# EAGLE board Blueberry Pi (EAGLE 9.0.0), part 1 of 2
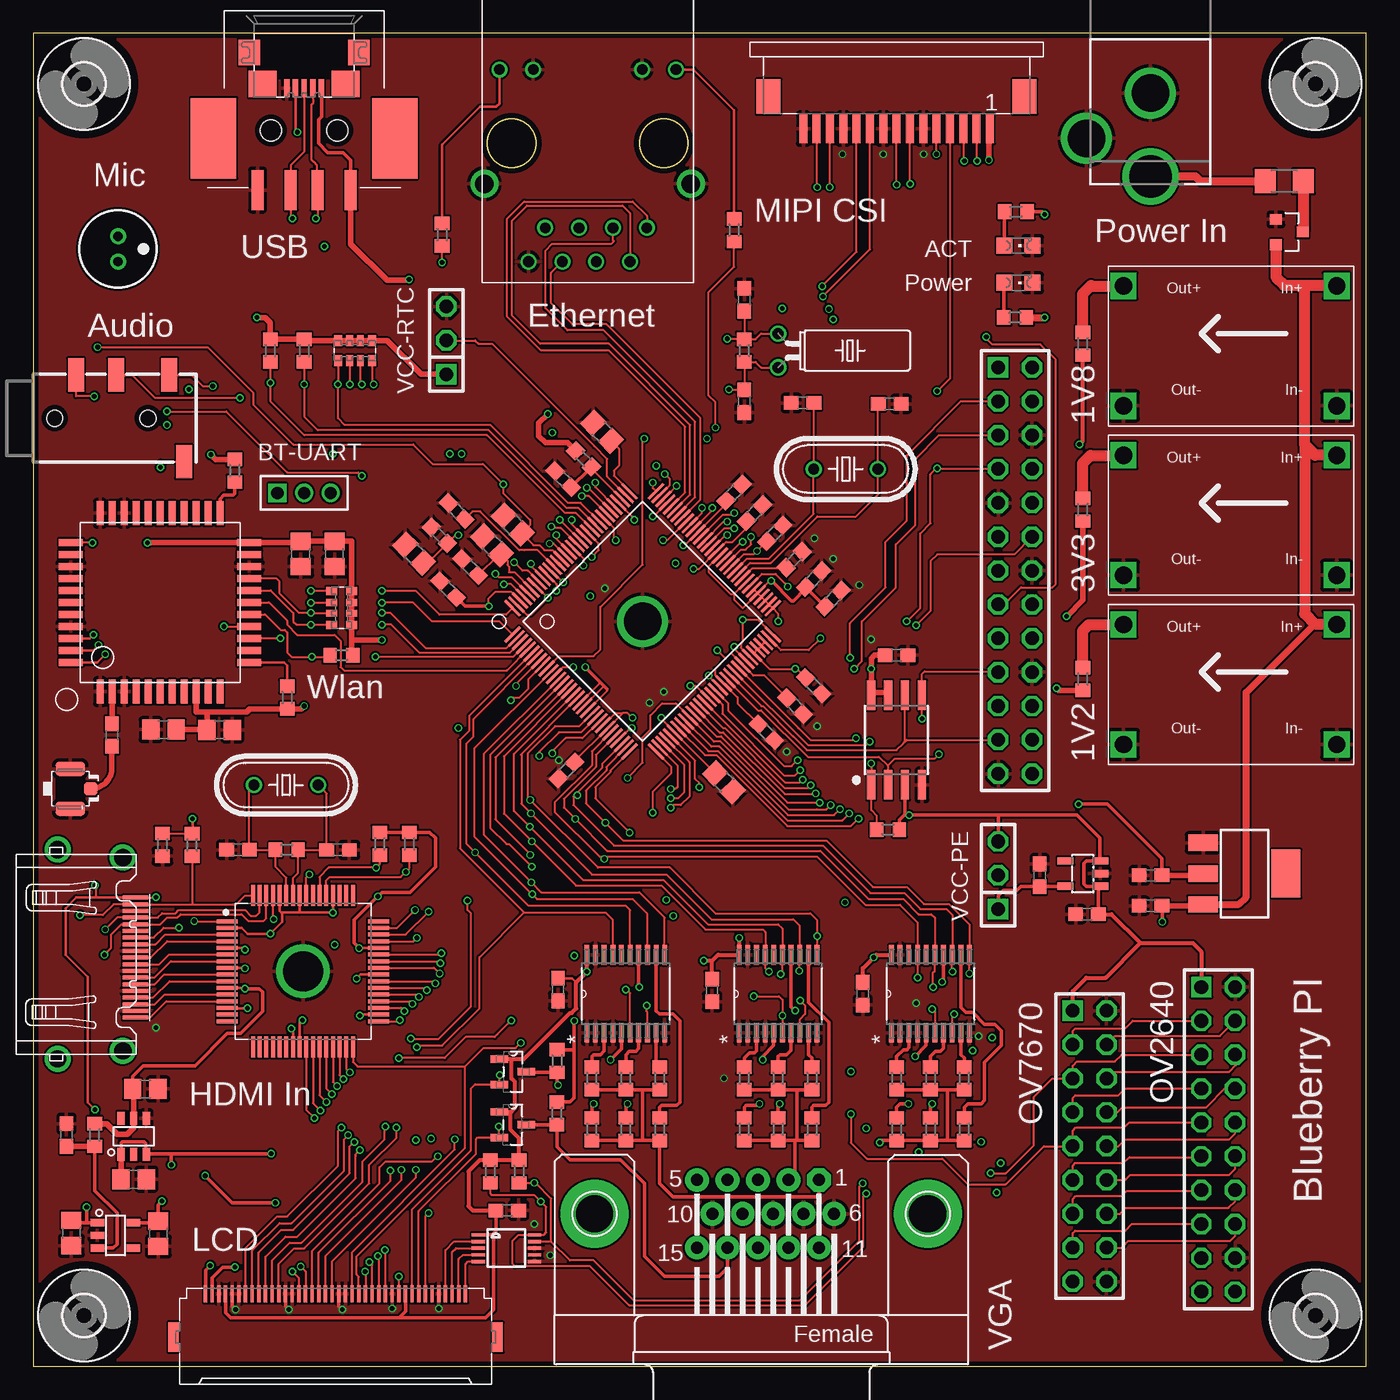
[diagram p6: board, top side]
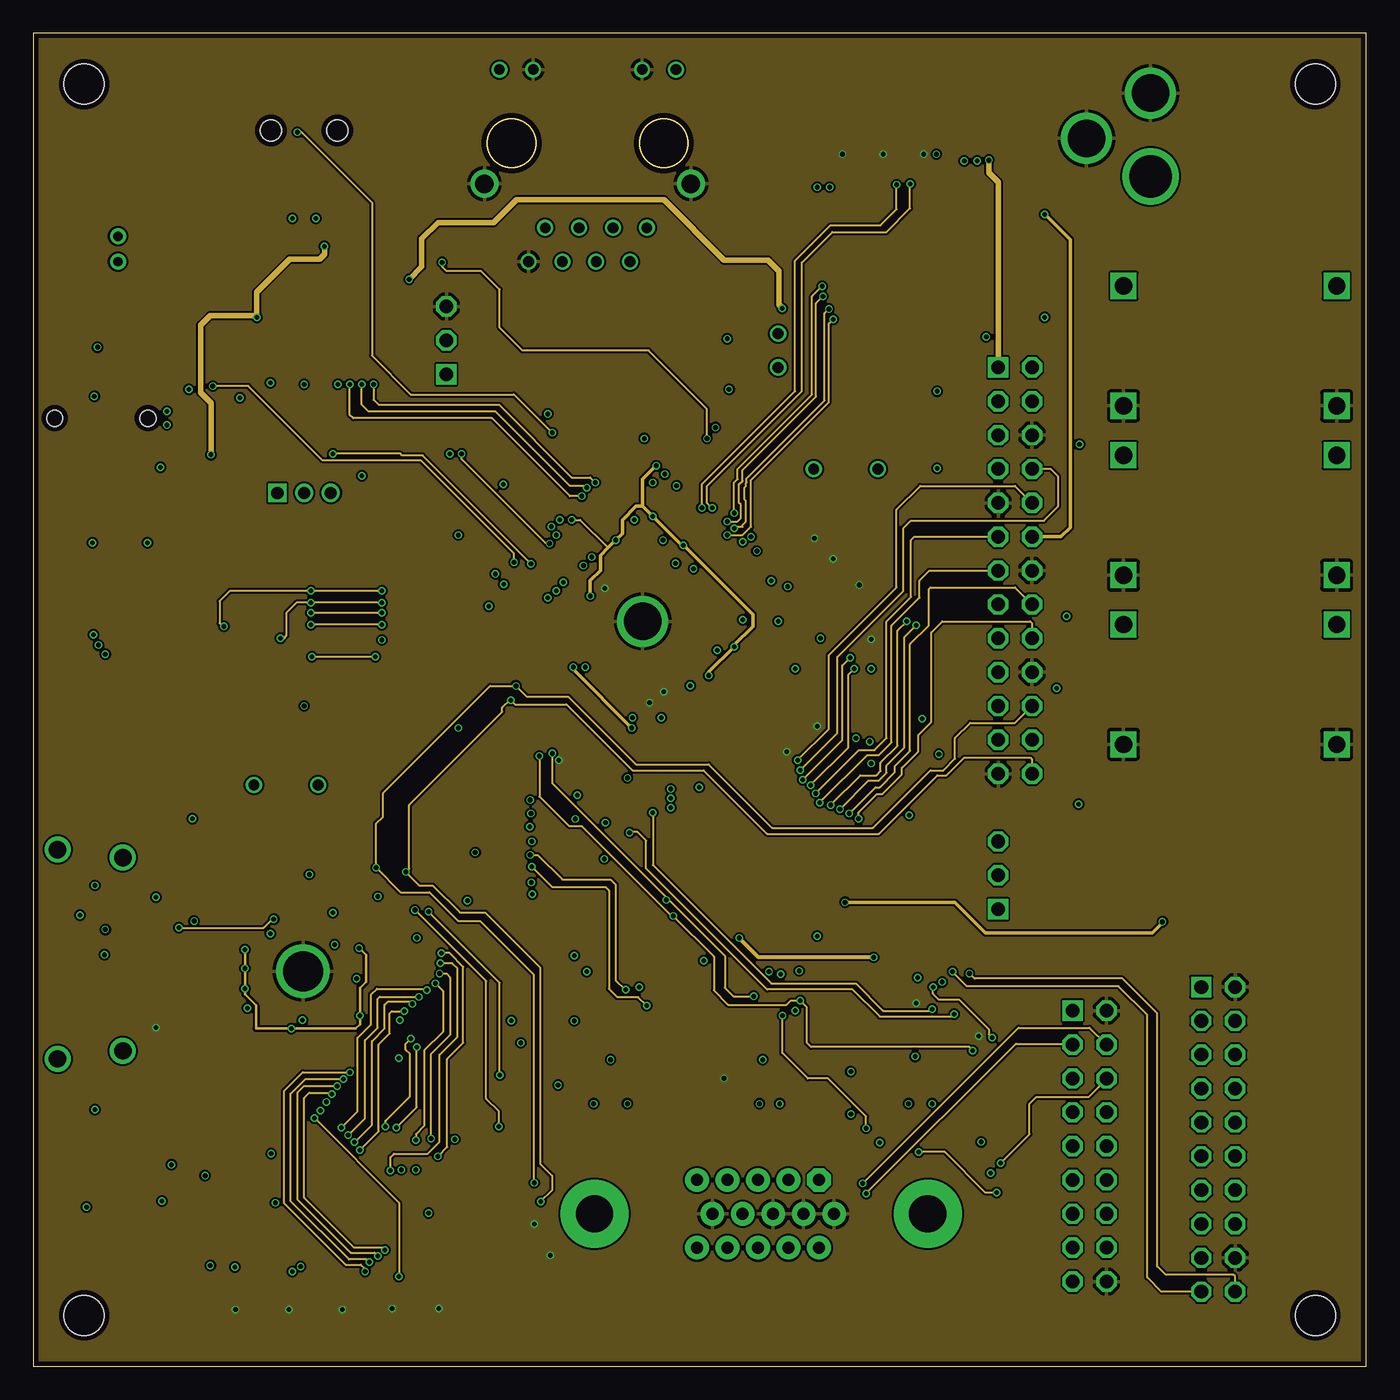
[diagram p7: board, inner layer Route2]
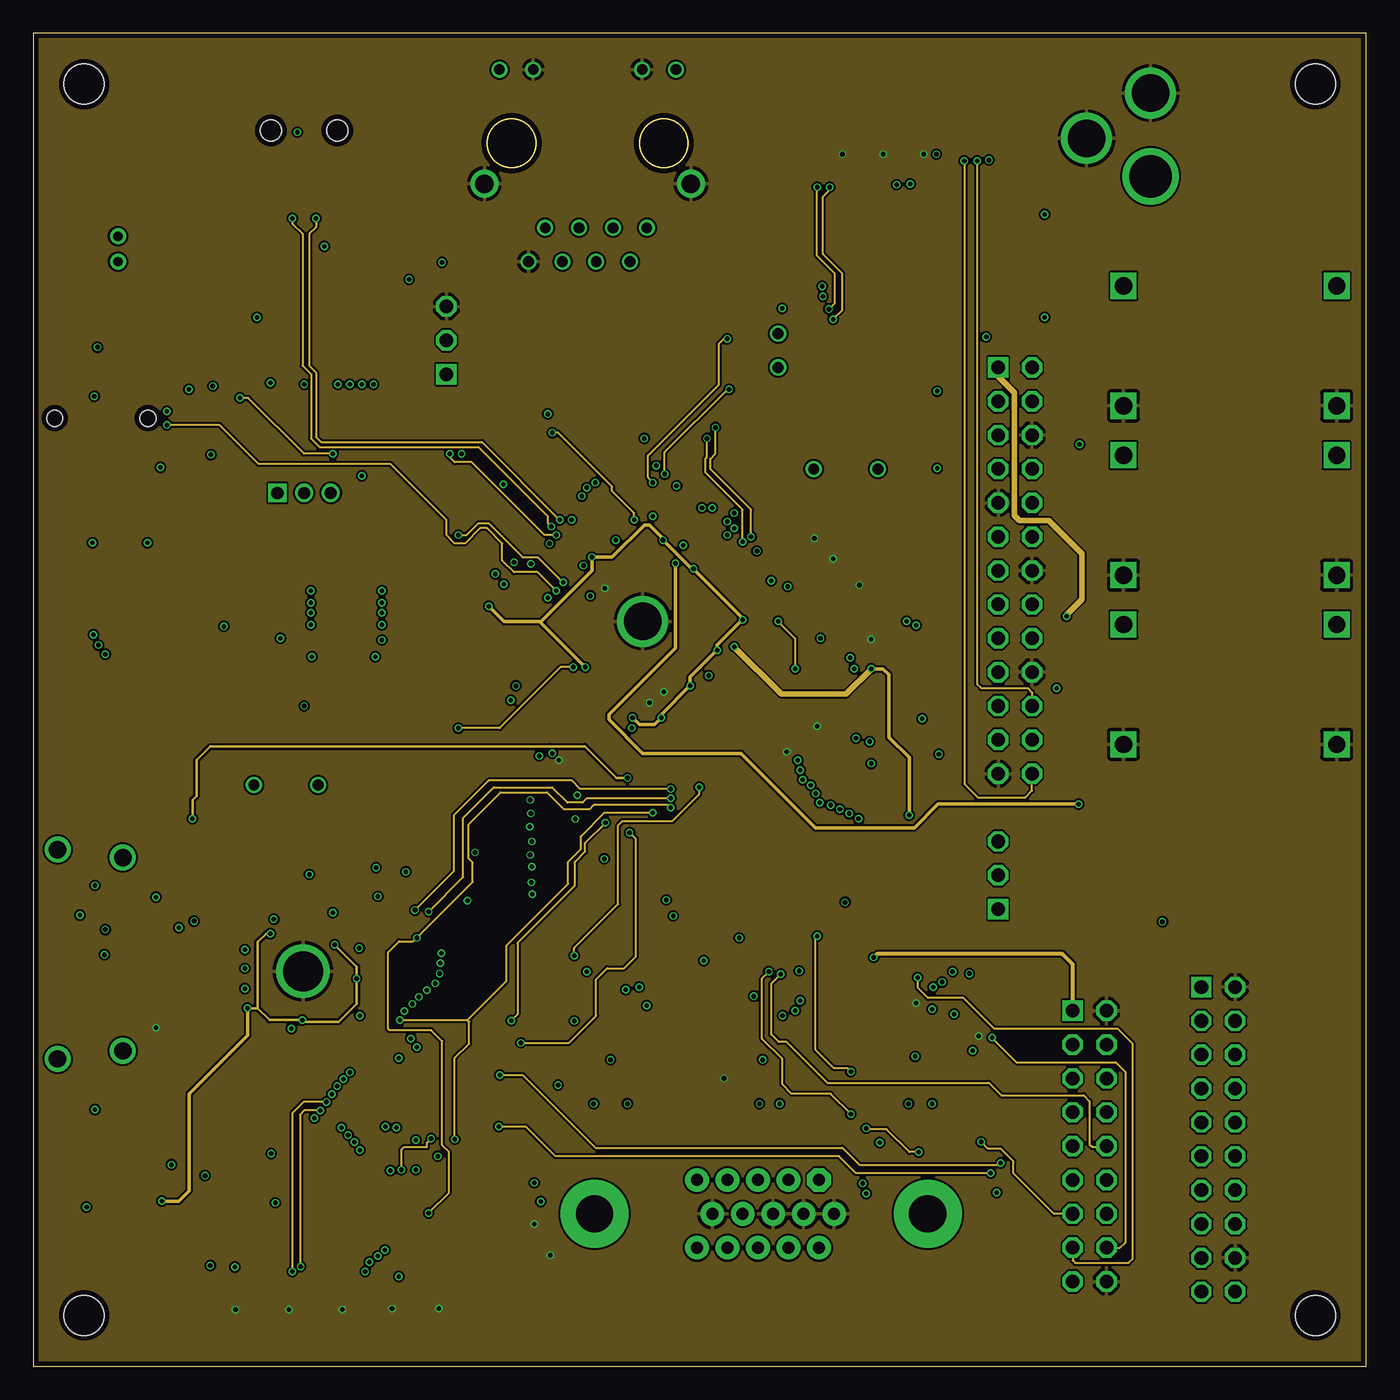
[diagram p8: board, inner layer Route15]
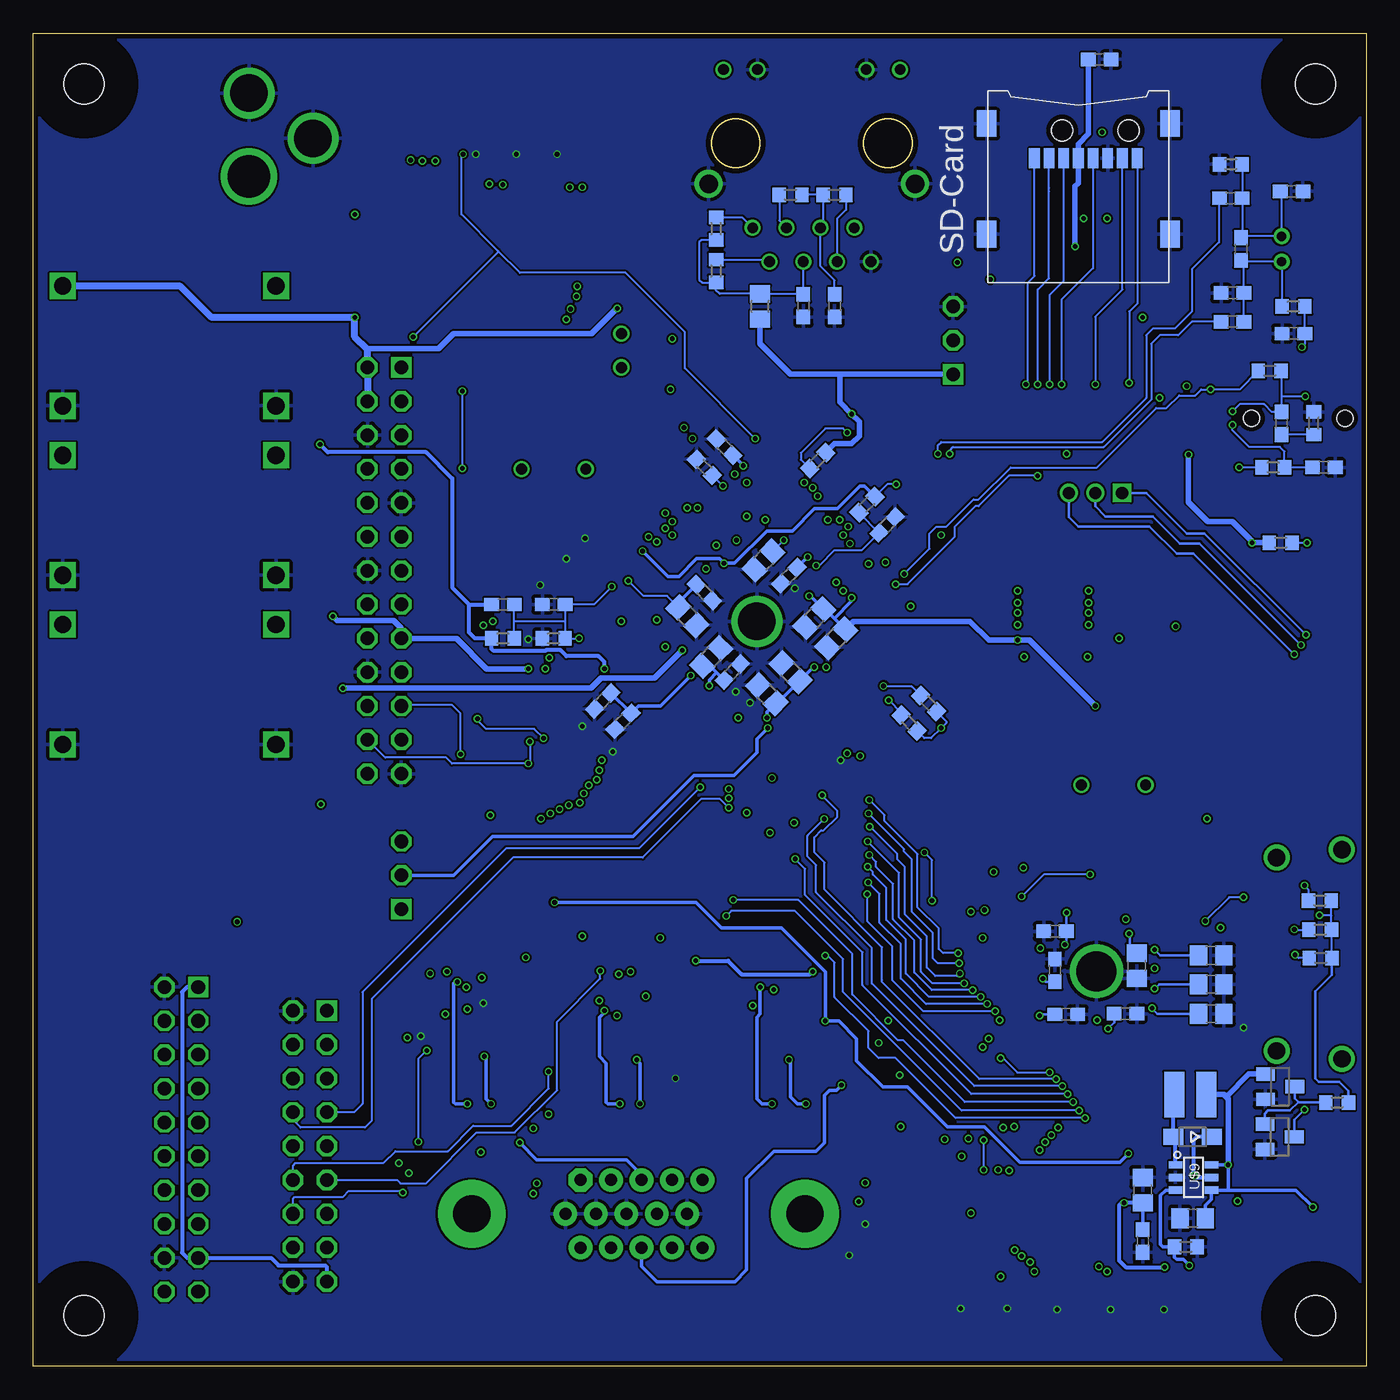
[diagram p9: board, bottom side, seen from below]

Size 100 x 100 mm. Coordinates in mm from the lower left corner, seen from the top.
Outline: 0,0 100,0 100,100 0,100 0,0
Copper layers (1*2*15*16): Top 0.035559375mm / dielectric 0.17018125mm / Route2 0.01778125mm / dielectric 47mil / Route15 0.01778125mm / dielectric 0.17018125mm / Bottom 0.035559375mm
Design rules "oshpark-4layer": minimum track width 5mil, minimum drill 10mil, track to track 5mil, track to pad 5mil, pad to pad 5mil, via to via 5mil, smd to smd 5mil, copper to edge 15mil, drill to drill 6mil, minimum pad ring 4mil, minimum via ring 4mil, stop-mask expansion 2.5mil, vias tented up to drill 0mil, thermal gap 10mil
Net classes: 0 default: clearance 0.152 mm

## Footprints (pad centres in the part's own frame; a part is rotated, then mirrored left to right if it is on the bottom)
U-FL3P-SMD-2.6X2.6X1.0MM = smd 1.05 x 1: D -1.524,0 | smd 2.2 x 1.05: GND1 0,1.5; GND2 0,-1.5
C0603 = smd 1.1 x 1: 1 -0.85,0; 2 0.85,0
C0805 = smd 1.3 x 1.5: 1 -0.95,0; 2 0.95,0
DCJACK_2MM_PTH = drill 2.8: GND 0,7.35; GNDBREAK 4.8,10.75 | drill 3.2: PWR 0,13.6
SOD323-W = smd 1.5 x 1.2: A 1.45,0; C -1.45,0
R1206 = smd 1.6 x 1.803: 1 -1.422,0; 2 1.422,0
3,0 = hole 3: 0,0
SOT223 = smd 1.219 x 2.235: 1 -2.311,-3.099; 2 0,-3.099; 3 2.311,-3.099 | smd 3.6 x 2.2: 4 0,3.099
TRANSFLASH-LOCK-SOCK = smd 0.8 x 1.5: 1 3.3,-0.46; 2 2.2,-0.46; 3 1.1,-0.46; 4 0,-0.46; 5 -1.1,-0.46; 6 -2.2,-0.46; 7 -3.3,-0.46; 8 -4.4,-0.46 | smd 1.45 x 2: S1 -6.875,-3.06; S2 -6.875,5.24; S3 6.875,5.24; S4 6.875,-3.06
AUDIO_JACK_3.5MM_TRRS_SMD_RA = smd 1.2 x 2.5: EARTH 11.3,-3.25; RING1 6.2,3.25; RING2 3.2,3.25; TIP 10.2,3.25 | hole 1.2: 1.6,0; 8.6,0
XF2H-4015-1LW = smd 1.3 x 0.25: 1 3.175,9.75; 2 3.175,9.25; 3 3.175,8.75; 4 3.175,8.25; 5 3.175,7.75; 6 3.175,7.25; 7 3.175,6.75; 8 3.175,6.25; 9 3.175,5.75; 10 3.175,5.25; 11 3.175,4.75; 12 3.175,4.25; 13 3.175,3.75; 14 3.175,3.25; 15 3.175,2.75; 16 3.175,2.25; 17 3.175,1.75; 18 3.175,1.25; 19 3.175,0.75; 20 3.175,0.25; 21 3.175,-0.25; 22 3.175,-0.75; 23 3.175,-1.25; 24 3.175,-1.75; 25 3.175,-2.25; 26 3.175,-2.75; 27 3.175,-3.25; 28 3.175,-3.75; 29 3.175,-4.25; 30 3.175,-4.75; 31 3.175,-5.25; 32 3.175,-5.75; 33 3.175,-6.25; 34 3.175,-6.75; 35 3.175,-7.25; 36 3.175,-7.75; 37 3.175,-8.25; 38 3.175,-8.75; 39 3.175,-9.25; 40 3.175,-9.75 | smd 2.2 x 0.8: M1 -0.075,12.15; M2 -0.075,-12.15
68611514122 = smd 0.6 x 2.2: 1 -7,2.4; 2 -6,2.4; 3 -5,2.4; 4 -4,2.4; 5 -3,2.4; 6 -2,2.4; 7 -1,2.4; 8 0,2.4; 9 1,2.4; 10 2,2.4; 11 3,2.4; 12 4,2.4; 13 5,2.4; 14 6,2.4; 15 7,2.4 | smd 1.8 x 2.6: Z1 -9.6,0; Z2 9.6,0
2X13 = drill 1.016 square: 1 -15.24,-1.27 | drill 1.016 octagon: 2 -15.24,1.27; 3 -12.7,-1.27; 4 -12.7,1.27; 5 -10.16,-1.27; 6 -10.16,1.27; 7 -7.62,-1.27; 8 -7.62,1.27; 9 -5.08,-1.27; 10 -5.08,1.27; 11 -2.54,-1.27; 12 -2.54,1.27; 13 0,-1.27; 14 0,1.27; 15 2.54,-1.27; 16 2.54,1.27; 17 5.08,-1.27; 18 5.08,1.27; 19 7.62,-1.27; 20 7.62,1.27; 21 10.16,-1.27; 22 10.16,1.27; 23 12.7,-1.27; 24 12.7,1.27; 25 15.24,-1.27; 26 15.24,1.27
1X03 = drill 1.016 square: 1 -2.54,0 | drill 1.016 octagon: 2 0,0; 3 2.54,0
2X09 = drill 1.016 square: 1 -10.16,-1.27 | drill 1.016 octagon: 2 -10.16,1.27; 3 -7.62,-1.27; 4 -7.62,1.27; 5 -5.08,-1.27; 6 -5.08,1.27; 7 -2.54,-1.27; 8 -2.54,1.27; 9 0,-1.27; 10 0,1.27; 11 2.54,-1.27; 12 2.54,1.27; 13 5.08,-1.27; 14 5.08,1.27; 15 7.62,-1.27; 16 7.62,1.27; 17 10.16,-1.27; 18 10.16,1.27
1X03M = drill 0.914 square: 1 -2,0 | drill 0.914: 2 0,0; 3 2,0
2X10 = drill 1.016 square: 1 -11.43,-1.27 | drill 1.016 octagon: 2 -11.43,1.27; 3 -8.89,-1.27; 4 -8.89,1.27; 5 -6.35,-1.27; 6 -6.35,1.27; 7 -3.81,-1.27; 8 -3.81,1.27; 9 -1.27,-1.27; 10 -1.27,1.27; 11 1.27,-1.27; 12 1.27,1.27; 13 3.81,-1.27; 14 3.81,1.27; 15 6.35,-1.27; 16 6.35,1.27; 17 8.89,-1.27; 18 8.89,1.27; 19 11.43,-1.27; 20 11.43,1.27
ODD-INDUCTOR = smd 1.5 x 3.4: P$1 -1.2,0; P$2 1.2,0
L0805 = smd 1.3 x 1.5: 1 -0.95,0; 2 0.95,0
CHIPLED_0805 = smd 1.2 x 1.2: A 0,-1.05; C 0,1.05
F6035AP = drill 0.7 pad 1.2: 1 0,0.95; 2 0,-0.95
HC49U-V = drill 0.813: 1 -2.413,0; 2 2.413,0
TC38H = drill 0.813: 1 -1.27,0; 2 1.27,0
HC49/S = drill 0.813: 1 -2.413,0; 2 2.413,0
SOT23 = smd 1 x 1.4: 1 -0.95,-1.1; 2 0.95,-1.1; 3 0,1.1
R0603 = smd 1 x 1.1: 1 -0.85,0; 2 0.85,0
EXB38V = smd 0.6 x 0.8: 1 -1.275,-0.75; 4 1.275,-0.75; 5 1.275,0.75; 8 -1.275,0.75 | smd 0.5 x 0.8: 2 -0.4,-0.75; 3 0.4,-0.75; 6 0.4,0.75; 7 -0.4,0.75
SO08-EIAJ = smd 0.61 x 2.21: 1 -1.905,-3.378; 2 -0.635,-3.378; 3 0.635,-3.378; 4 1.905,-3.378; 5 1.905,3.353; 6 0.635,3.353; 7 -0.635,3.353; 8 -1.905,3.353
SOP65P640X120-20N = smd 1.473 x 0.356: 1 -2.921,2.921; 2 -2.921,2.286; 3 -2.921,1.626; 4 -2.921,0.965; 5 -2.921,0.33; 6 -2.921,-0.33; 7 -2.921,-0.965; 8 -2.921,-1.626; 9 -2.921,-2.286; 10 -2.921,-2.921; 11 2.921,-2.921; 12 2.921,-2.286; 13 2.921,-1.626; 14 2.921,-0.965; 15 2.921,-0.33; 16 2.921,0.33; 17 2.921,0.965; 18 2.921,1.626; 19 2.921,2.286; 20 2.921,2.921
SOT95P240X110-3N = smd 1.321 x 0.559: 1 -1.016,0.965; 2 -1.016,-0.965; 3 1.016,0
QFP-128 = smd 0.2 x 1.6: 1 -6.2,-7.6; 2 -5.8,-7.6; 3 -5.4,-7.6; 4 -5,-7.6; 5 -4.6,-7.6; 6 -4.2,-7.6; 7 -3.8,-7.6; 8 -3.4,-7.6; 9 -3,-7.6; 10 -2.6,-7.6; 11 -2.2,-7.6; 12 -1.8,-7.6; 13 -1.4,-7.6; 14 -1,-7.6; 15 -0.6,-7.6; 16 -0.2,-7.6; 17 0.2,-7.6; 18 0.6,-7.6; 19 1,-7.6; 20 1.4,-7.6; 21 1.8,-7.6; 22 2.2,-7.6; 23 2.6,-7.6; 24 3,-7.6; 25 3.4,-7.6; 26 3.8,-7.6; 27 4.2,-7.6; 28 4.6,-7.6; 29 5,-7.6; 30 5.4,-7.6; 31 5.8,-7.6; 32 6.2,-7.6; 65 6.2,7.6; 66 5.8,7.6; 67 5.4,7.6; 68 5,7.6; 69 4.6,7.6; 70 4.2,7.6; 71 3.8,7.6; 72 3.4,7.6; 73 3,7.6; 74 2.6,7.6; 75 2.2,7.6; 76 1.8,7.6; 77 1.4,7.6; 78 1,7.6; 79 0.6,7.6; 80 0.2,7.6; 81 -0.2,7.6; 82 -0.6,7.6; 83 -1,7.6; 84 -1.4,7.6; 85 -1.8,7.6; 86 -2.2,7.6; 87 -2.6,7.6; 88 -3,7.6; 89 -3.4,7.6; 90 -3.8,7.6; 91 -4.2,7.6; 92 -4.6,7.6; 93 -5,7.6; 94 -5.4,7.6; 95 -5.8,7.6; 96 -6.2,7.6 | smd 1.6 x 0.2: 33 7.6,-6.2; 34 7.6,-5.8; 35 7.6,-5.4; 36 7.6,-5; 37 7.6,-4.6; 38 7.6,-4.2; 39 7.6,-3.8; 40 7.6,-3.4; 41 7.6,-3; 42 7.6,-2.6; 43 7.6,-2.2; 44 7.6,-1.8; 45 7.6,-1.4; 46 7.6,-1; 47 7.6,-0.6; 48 7.6,-0.2; 49 7.6,0.2; 50 7.6,0.6; 51 7.6,1; 52 7.6,1.4; 53 7.6,1.8; 54 7.6,2.2; 55 7.6,2.6; 56 7.6,3; 57 7.6,3.4; 58 7.6,3.8; 59 7.6,4.2; 60 7.6,4.6; 61 7.6,5; 62 7.6,5.4; 63 7.6,5.8; 64 7.6,6.2; 97 -7.6,6.2; 98 -7.6,5.8; 99 -7.6,5.4; 100 -7.6,5; 101 -7.6,4.6; 102 -7.6,4.2; 103 -7.6,3.8; 104 -7.6,3.4; 105 -7.6,3; 106 -7.6,2.6; 107 -7.6,2.2; 108 -7.6,1.8; 109 -7.6,1.4; 110 -7.6,1; 111 -7.6,0.6; 112 -7.6,0.2; 113 -7.6,-0.2; 114 -7.6,-0.6; 115 -7.6,-1; 116 -7.6,-1.4; 117 -7.6,-1.8; 118 -7.6,-2.2; 119 -7.6,-2.6; 120 -7.6,-3; 121 -7.6,-3.4; 122 -7.6,-3.8; 123 -7.6,-4.2; 124 -7.6,-4.6; 125 -7.6,-5; 126 -7.6,-5.4; 127 -7.6,-5.8; 128 -7.6,-6.2 | drill 2.8: P$1 0,0
LGA = smd 1.8 x 0.51: P$1 -0.7,10.5; P$2 -0.7,9.6; P$3 -0.7,8.7; P$4 -0.7,7.8; P$5 -0.7,6.9; P$6 -0.7,6; P$7 -0.7,5.1; P$8 -0.7,4.2; P$9 -0.7,3.3; P$10 -0.7,2.4; P$11 -0.7,1.5; P$23 12.7,1.5; P$24 12.7,2.4; P$25 12.7,3.3; P$26 12.7,4.2; P$27 12.7,5.1; P$28 12.7,6; P$29 12.7,6.9; P$30 12.7,7.8; P$31 12.7,8.7; P$32 12.7,9.6; P$33 12.7,10.5 | smd 0.51 x 1.8: P$12 1.5,-0.7; P$13 2.4,-0.7; P$14 3.3,-0.7; P$15 4.2,-0.7; P$16 5.1,-0.7; P$17 6,-0.7; P$18 6.9,-0.7; P$19 7.8,-0.7; P$20 8.7,-0.7; P$21 9.6,-0.7; P$22 10.5,-0.7; P$34 10.5,12.7; P$35 9.6,12.7; P$36 8.7,12.7; P$37 7.8,12.7; P$38 6.9,12.7; P$39 6,12.7; P$40 5.1,12.7; P$41 4.2,12.7; P$42 3.3,12.7; P$43 2.4,12.7; P$44 1.5,12.7
RJ45 = drill 0.8: 1 -6.03,-4.12; 2 -8.57,-2.86; 3 -6.03,-1.58; 4 -8.57,-0.32; 5 -6.03,0.96; 6 -8.57,2.22; 7 -6.03,3.5; 8 -8.57,4.76; 9 5.84,-6.305; 10 5.84,-3.765; 11 5.84,4.405; 12 5.84,6.945 | drill 1.4: SHIELD1 -2.73,-7.425; SHIELD2 -2.73,8.065
MINI-DC-BRICK = drill 1.3 square: P$1 0,9.23; P$2 0,0.23; P$3 16,0.23; P$4 16,9.23
QFP50P1210X1210X120-65T500 = smd 1.579 x 0.302: 1 -5.675,3.75; 2 -5.675,3.25; 3 -5.675,2.75; 4 -5.675,2.25; 5 -5.675,1.75; 6 -5.675,1.25; 7 -5.675,0.75; 8 -5.675,0.25; 9 -5.675,-0.25; 10 -5.675,-0.75; 11 -5.675,-1.25; 12 -5.675,-1.75; 13 -5.675,-2.25; 14 -5.675,-2.75; 15 -5.675,-3.25; 16 -5.675,-3.75; 33 5.675,-3.75; 34 5.675,-3.25; 35 5.675,-2.75; 36 5.675,-2.25; 37 5.675,-1.75; 38 5.675,-1.25; 39 5.675,-0.75; 40 5.675,-0.25; 41 5.675,0.25; 42 5.675,0.75; 43 5.675,1.25; 44 5.675,1.75; 45 5.675,2.25; 46 5.675,2.75; 47 5.675,3.25; 48 5.675,3.75 | smd 0.302 x 1.579: 17 -3.75,-5.675; 18 -3.25,-5.675; 19 -2.75,-5.675; 20 -2.25,-5.675; 21 -1.75,-5.675; 22 -1.25,-5.675; 23 -0.75,-5.675; 24 -0.25,-5.675; 25 0.25,-5.675; 26 0.75,-5.675; 27 1.25,-5.675; 28 1.75,-5.675; 29 2.25,-5.675; 30 2.75,-5.675; 31 3.25,-5.675; 32 3.75,-5.675; 49 3.75,5.675; 50 3.25,5.675; 51 2.75,5.675; 52 2.25,5.675; 53 1.75,5.675; 54 1.25,5.675; 55 0.75,5.675; 56 0.25,5.675; 57 -0.25,5.675; 58 -0.75,5.675; 59 -1.25,5.675; 60 -1.75,5.675; 61 -2.25,5.675; 62 -2.75,5.675; 63 -3.25,5.675; 64 -3.75,5.675 | drill 3: P$1 0,0
SOT25 = smd 0.55 x 1.2: 1 -0.95,-1.3; 2 0,-1.3; 3 0.95,-1.3; 4 0.95,1.3; 5 -0.95,1.3
SOT23-3 = smd 0.8 x 0.9: 1 -0.95,-1; 2 0.95,-1; 3 0,1
MSOP10 = smd 0.25 x 1: 1 -1,-2.113; 2 -0.5,-2.113; 3 0,-2.113; 4 0.5,-2.113; 5 1,-2.113; 6 1,2.113; 7 0.5,2.113; 8 0,2.113; 9 -0.5,2.113; 10 -1,2.113
SOT23-6 = smd 1 x 0.55: 1 -1.35,0.95; 2 -1.35,0; 3 -1.35,-0.95; 4 1.35,-0.95; 5 1.35,0; 6 1.35,0.95
HDMI_A = smd 0.3 x 1.9: P$1 4.75,3.95; P$2 4.25,3.95; P$3 3.75,3.95; P$4 3.25,3.95; P$5 2.75,3.95; P$6 2.25,3.95; P$7 1.75,3.95; P$8 1.25,3.95; P$9 0.75,3.95; P$10 0.25,3.95; P$11 -0.25,3.95; P$12 -0.75,3.95; P$13 -1.25,3.95; P$14 -1.75,3.95; P$15 -2.25,3.95; P$16 -2.75,3.95; P$17 -3.25,3.95; P$18 -3.75,3.95; P$19 -4.25,3.95 | drill 1.3: P$20 -7.25,3; P$21 7.25,3; P$22 7.85,-1.9; P$23 -7.85,-1.9
SOT-25 = smd 1 x 0.55: 1 -1.35,0.95; 2 -1.35,0; 3 -1.35,-0.95; 4 1.35,-0.95; 5 1.35,0; 6 1.35,0.95
SOT-23-5 = smd 1 x 0.55: 1 -1.35,0.95; 2 -1.35,0; 3 -1.35,-0.95; 4 1.35,-0.95; 5 1.35,0.95
CON-HIROSE_ZX62R-B-5P = smd 1.35 x 0.4: 1 2.675,1.3; 2 2.675,0.65; 3 2.675,0; 4 2.675,-0.65; 5 2.675,-1.3 | smd 1.9 x 1.6: M1 0,-4.1; M2 0,4.1 | smd 2 x 2.1: M3 2.35,3.1; M4 2.35,-3.1
USB-B-SMT = smd 6.04 x 3.4: 5 0.58,6.8; 6 0.58,-6.8 | smd 3 x 0.9: D+ 4.46,-1; D- 4.46,1; GND 4.46,-3.5; VBUS 4.46,3.5 | hole 1.6: 0,2.5; 0,-2.5
HDF15H = drill 0.9 pad 1.778 octagon: 1 4.329,2.54 | drill 0.9 pad 1.778: 2 2.043,2.54; 3 -0.243,2.54; 4 -2.529,2.54; 5 -4.815,2.54; 6 5.472,0; 7 3.186,0; 8 0.9,0; 9 -1.386,0; 10 -3.672,0; 11 4.329,-2.54; 12 2.043,-2.54; 13 -0.243,-2.54; 14 -2.529,-2.54; 15 -4.815,-2.54 | drill 2.8 pad 5.08: P$1 -12.5,0; P$2 12.5,0

## Placement (x,y rotation side)
ANT2  U-FL  [U-FL3P-SMD-2.6X2.6X1.0MM]  2.78,43.31 180 top
C1  100nF  [C0603]  64.77,53.34 0 top
C2  100nF  [C0603]  35.56,11.68 0 top
C3  10µF  [C0805]  22.6,60.94 270 top
C4  33pF  [C0603]  5.9,47.36 270 top
C5  10µF  [C0805]  20.06,60.94 270 top
C6  10µF  [C0805]  9.76,47.76 180 top
C7  10µF  [C0805]  42.67,70.1 135 top
C8  18pF  [C0603]  53.34,80.01 90 top
C9  100nF  [C0603]  19.99,98.04 0 bottom
C10  18pF  [C0603]  53.34,72.39 270 top
C11  18pF  [C0603]  64.26,72.2 180 top
C12  18pF  [C0603]  57.72,72.26 0 top
C13  1µF  [C0603]  39.75,66.55 135 top
C14  100nF  [C0603]  64.77,57.15 180 bottom
C15  100nF  [C0603]  60.96,57.15 0 bottom
C16  10µF  [C0805]  35.97,63.15 315 top
C17  1µF  [C0603]  3.17,67.44 0 bottom
C18  100nF  [C0603]  6.35,70.74 90 bottom
C20  10µF  [C0805]  28.57,60.96 315 top
C21  1µF  [C0603]  31.77,64.15 315 top
C22  100nF  [C0603]  32.77,59.94 135 top
C23  33pF  [C0603]  10.03,80.52 0 bottom
C24  33pF  [C0603]  5.59,88.14 180 bottom
C25  100pF  [C0603]  9.4,83.82 270 bottom
C26  33pF  [C0603]  5.46,77.47 0 bottom
C27  100nF  [C0603]  10.03,78.36 0 bottom
C28  100nF  [C0603]  10.16,87.63 0 bottom
C29  10µF  [C0805]  34.42,61.59 315 top
C30  10µF  [C0805]  13.99,47.75 0 top
C31  100nf  [C0603]  79.06,33.91 180 top
C32  100nF  [C0603]  39.37,28.26 90 top
C33  100nF  [C0603]  62.23,27.94 90 top
C34  1nF  [C0603]  35.94,63.12 225 bottom
C35  100nF  [C0603]  50.93,28.19 90 top
C36  100nf  [C0603]  83.82,34.54 180 top
C37  100nf  [C0603]  83.82,36.83 180 top
C38  10µF  [C0603]  58.55,51.05 135 top
C39  1µF  [C0603]  58.55,59.05 45 top
C40  47pF  [C0603]  15.35,38.75 180 top
C41  47pF  [C0603]  22.86,38.73 0 top
C42  470pF  [C0603]  2.49,17.35 90 top
C43  10µF  [C0805]  8.41,20.8 0 top
C44  10µF  [C0805]  7.53,14.02 0 top
C45  10µF  [C0805]  9.38,9.95 270 top
C46  10µF  [C0805]  11.63,26.45 0 bottom
C47  1µF  [C0603]  60.01,57.59 45 top
C48  100nF  [C0603]  39.88,79.57 270 bottom
C49  100nF  [C0603]  42.23,79.57 270 bottom
C50  10µF  [C0805]  50.93,56.26 315 bottom
C51  100nF  [C0603]  49.66,58.04 315 bottom
C52  100nF  [C0805]  49.15,53.21 45 bottom
C53  100nF  [C0603]  31.11,58.29 135 top
C54  1µF  [C0805]  43.18,52.07 135 bottom
C55  1µF  [C0603]  43.31,59.31 225 bottom
C56  10µF  [C0603]  47.56,52.07 45 bottom
C57  100nF  [C0603]  57.28,49.91 225 bottom
C58  100nF  [C0603]  52.58,65.53 45 top
C59  10µF  [C0805]  45.21,60.45 225 bottom
C60  10µF  [C0603]  48.13,68.96 135 bottom
C61  1µF  [C0805]  41.4,56.13 225 bottom
C62  100nF  [C0603]  57.15,49.53 315 top
C63  100nF  [C0805]  51.82,43.81 315 top
C64  1µF  [C0603]  54.1,64.01 45 top
C65  1µF  [C0603]  40.01,44.7 225 top
C66  10µF  [C0805]  44.96,50.42 135 bottom
C67  100nF  [C0603]  54.99,47.56 315 top
C69  100nF  [C0805]  39.75,54.61 225 bottom
C70  100nF  [C0603]  55.75,48.39 225 bottom
C71  10µF  [C0603]  55.63,62.48 45 top
C73  10µF  [C0805]  13.02,11.11 180 bottom
C74  10µF  [C0805]  16.76,13.21 90 bottom
C75  100nf  [C0603]  16.76,9.4 270 bottom
C76  100nf  [C0603]  75.5,36.83 90 top
C77  100nF  [C0603]  23.35,29.69 90 bottom
C78  10µF  [C0805]  17.21,30.04 270 bottom
C79  100nF  [C0603]  23.34,32.63 180 bottom
C80  10µF  [C0805]  11.63,28.66 0 bottom
C81  100nF  [C0603]  18.06,26.45 0 bottom
C82  10µF  [C0805]  11.63,30.82 0 bottom
C83  100nF  [C0603]  22.5,26.4 0 bottom
C84  10µF  [C0805]  2.86,9.99 270 top
CN2  [DCJACK_2MM_PTH]  83.82,102.87 180 top
D1  [SOD323-W]  13.02,17.21 180 bottom
F1  2A  [R1206]  93.85,88.9 0 top
H1  MOUNT-HOLE3.0  [3,0]  3.81,3.81 0 top
H2  MOUNT-HOLE3.0  [3,0]  96.19,96.19 0 top
H3  MOUNT-HOLE3.0  [3,0]  96.19,3.81 0 top
H4  MOUNT-HOLE3.0  [3,0]  3.81,96.19 0 top
IC1  [SOT223]  90.87,36.96 270 top
J1  TRANSFLASH-LOCK  [TRANSFLASH-LOCK-SOCK]  21.59,90.17 180 bottom
J2  AUDIO_JACK_SMD  [AUDIO_JACK_3.5MM_TRRS_SMD_RA]  0,71.12 0 top
J3  [XF2H-4015-1LW]  22.67,2.25 90 top
J4  [68611514122]  64.77,95.25 180 top
JP1  [2X13]  73.66,59.69 270 top
JP3  [1X03]  72.39,36.83 90 top
JP5  VCC-RTC  [1X03]  30.99,76.96 90 top
JP6  OV7670  [2X09]  79.25,16.51 270 top
JP7  [1X03M]  20.31,65.52 0 top
JP10  OV2640  [2X10]  88.9,17.02 270 top
L1  2,2µH  [ODD-INDUCTOR]  13.21,20.38 180 bottom
L2  10µH  [L0805]  45.47,79.5 90 bottom
LED1  [CHIPLED_0805]  73.91,81.28 270 top
LED2  [CHIPLED_0805]  73.91,84.07 270 top
MIC  [F6035AP]  6.35,83.82 0 top
Q1  24Mhz  [HC49U-V]  60.96,67.31 180 top
Q2  32kHz  [TC38H]  55.88,76.2 270 top
Q3  28.6363  [HC49/S]  18.96,43.6 180 top
Q4  BSS123  [SOT23]  6.46,20.97 270 bottom
Q5  BSS123  [SOT23]  6.5,17.2 270 bottom
R1  47k  [R0603]  20.32,76.2 90 top
R2  47k  [R0603]  17.78,76.2 90 top
R3  10M  [R0603]  53.34,76.2 90 top
R4  17,8k  [R0603]  67.31,17.78 90 top
R5  8,66k  [R0603]  69.85,17.78 90 top
R6  4,32k  [R0603]  69.85,21.59 90 top
R7  2,2k  [R0603]  67.31,21.59 90 top
R8  10k  [R0603]  64.14,40.26 0 top
R9  100k  [R0603]  19.05,50.16 90 top
R10  100k  [R0603]  6.41,61.79 180 bottom
R11  47k  [R0603]  41.27,68.07 135 top
R12  240 - 1%  [R0603]  57.09,60.52 45 top
R13  2k - 1%  [R0603]  64.77,54.61 180 bottom
R14  2k - 1%  [R0603]  60.96,54.61 0 bottom
R15  22  [R0603]  3.94,70.74 270 bottom
R16  1k  [R0603]  73.66,78.68 0 top
R17  1k  [R0603]  73.72,86.61 0 top
R18  1,05k  [R0603]  64.77,17.78 90 top
R19  10k  [R0603]  15.11,67.18 90 top
R24  6k 1%  [R0603]  49.66,67.44 135 bottom
R25  2k  [R0603]  6.99,67.44 0 bottom
R26  0  [R0603]  7.24,74.68 0 bottom
R27  200k 1%  [R0603]  30.46,62.34 315 top
R28  2k  [R0603]  10.16,90.17 180 bottom
R29  47k  [R0603]  37.47,64.64 45 bottom
R30  2k  [R0603]  5.46,79.5 0 bottom
R31  549  [R0603]  64.77,21.59 90 top
R32  47k  [R0603]  41.15,67.94 225 bottom
R33  17,8k  [R0603]  55.88,17.78 90 top
R34  8,66k  [R0603]  58.42,17.78 90 top
R35  4,32k  [R0603]  58.42,21.59 90 top
R36  47k  [R0603]  23.11,53.34 180 top
R37  2,2k  [R0603]  55.88,21.59 90 top
R38  10k  [R0603]  34.29,14.61 270 top
R39  10k  [R0603]  36.45,14.61 270 top
R40  49.9  [R0603]  43.18,87.88 0 bottom
R41  49.9  [R0603]  39.88,87.88 180 bottom
R42  49.9  [R0603]  48.77,85.34 270 bottom
R43  49.9  [R0603]  48.77,82.17 270 bottom
R44  10k  [R0603]  34.29,48.26 135 bottom
R45  10k  [R0603]  32.83,49.72 135 bottom
R46  1,05k  [R0603]  53.34,17.78 90 top
R47  5,1  [R0603]  13.53,8.95 0 bottom
R48  549  [R0603]  53.34,21.59 90 top
R49  17,8k  [R0603]  44.45,17.78 90 top
R50  8,66k  [R0603]  46.99,17.78 90 top
R51  4,32k  [R0603]  46.99,21.59 90 top
R52  1k  [R0603]  30.67,84.9 90 top
R53  1k  [R0603]  52.58,85.22 90 top
R54  2,2k  [R0603]  44.45,21.59 90 top
R55  1,05k  [R0603]  41.91,17.78 90 top
R56  549  [R0603]  41.91,21.59 90 top
R57  2K2  [R0603]  39.28,18.97 270 top
R58  2K2  [R0603]  39.3,22.89 270 top
R59  390k  [R0603]  19.02,38.74 180 top
R60  1k  [R0603]  3.46,34.93 0 bottom
R61  3k3  [R0603]  11.91,39.11 90 top
R62  3k3  [R0603]  9.69,39.12 270 top
R63  10k  [R0603]  3.45,32.74 180 bottom
R64  10k  [R0603]  3.42,30.62 180 bottom
R65  3k3  [R0603]  28.22,39.19 270 top
R66  100k  [R0603]  2.18,19.78 180 bottom
R67  3k3  [R0603]  25.99,39.19 90 top
R68  100k  [R0603]  4.61,17.34 90 top
R69  0R  [R0603]  78.74,64.26 270 top
R70  0R  [R0603]  78.74,76.71 270 top
R71  0R  [R0603]  78.74,51.56 270 top
RN1  [EXB38V]  23.13,56.89 90 top
RN2  [EXB38V]  24.13,76.2 180 top
U1  25F32006WSOI  [SO08-EIAJ]  64.77,46.99 0 top
U2  [SOP65P640X120-20N]  67.31,27.94 90 top
U3  [SOP65P640X120-20N]  55.88,27.94 90 top
U4  [SOP65P640X120-20N]  44.45,27.94 90 top
U5  [SOT95P240X110-3N]  35.97,18.12 0 top
U6  [SOT95P240X110-3N]  35.98,22.09 0 top
U$1  V3S  [QFP-128]  45.72,55.88 315 top
U$2  RTL8723BS  [LGA]  15.51,51.3 90 top
U$3  HR911105A  [RJ45]  41.91,91.44 90 top
U$4  MP1584-MINI  [MINI-DC-BRICK]  97.79,68.58 180 top
U$5  ADV7611  [QFP50P1210X1210X120-65T500]  20.23,29.63 0 top
U$6  XC6204  [SOT25]  78.74,36.96 90 top
U$7  AP2305BGN  [SOT23-3]  94.23,85.09 270 top
U$8  NS2009  [MSOP10]  35.5,8.85 270 top
U$9  PT4101  [SOT23-6]  12.95,14.16 0 bottom
U$10  MP1584-MINI  [MINI-DC-BRICK]  97.79,81.28 180 top
U$11  MP1584-MINI  [MINI-DC-BRICK]  97.79,55.88 180 top
U$12  HDMI-A  [HDMI_A]  3.72,30.9 270 top
U$13  XC6210B332MR-G  [SOT-25]  7.53,17.24 90 top
U$14  RT9013-18GB  [SOT-23-5]  6.16,9.82 0 top
U$15  [CON-HIROSE_ZX62R-B-5P]  20.32,98.55 270 top
X1  USB-B-S  [USB-B-SMT]  20.32,92.71 270 top
X2  [HDF15H]  54.61,11.43 0 top

## Tracks (layer width: path | path; a pad name or v marks a point on that pad's centre or on a via)
5VNS
  Top 0.61: CN2.PWR 87.2,89.27 87.57,88.9 F1.1
  Top 0.813: 92.37,88.84 F1.1
+1V2  (via drill 0.35)
  Top 0.152: v41.91,60.71 42.42,61.21 42.42,61.72 U$1.108 | v47.24,61.98 47.57,61.98 U$1.88 | v49.53,59.82 49.94,59.82 U$1.80 51.97,61.85 52.45,61.85 53.5,62.9 C64.1 | U$1.64 54.36,56.01 v53.21,56.01 53.21,54.36 53.09,54.23 53.09,53.89 U$1.58 | 51.94,53.09 51.18,52.32 51.18,51.83 U$1.51 52.83,50.18 52.83,49.72 C67.1 | v51.31,53.72 51.94,53.09 | 51.94,53.09 52.32,53.47 52.38,53.47 U$1.56 54.03,51.82 54.86,51.82 C62.1 | v49.28,51.05 49.7,51.05 U$1.47 | v47.12,48.64 47.12,48.54 U$1.38 51.14,44.52 C63.1 | v44.96,48.64 44.58,49.02 44.24,49.02 | 44.24,49.02 U$1.26 40.61,45.39 C65.1 | U$1.25 43.67,49.02 44.24,49.02 | U$1.19 42.48,51.23 42.48,51.37 | U$1.20 42.8,50.98 42.8,51.05 | U$1.21 43.05,50.67 43.05,50.8 | v34.16,57.02 34.16,57.59 34.67,58.1 35.86,58.1 U$1.126
  Top 0.254: v41.4,52.45 42.48,51.37 42.8,51.05 43.05,50.8 | v34.16,57.02 32.38,57.02 C53.1 | C53.1
  Top 0.406: R71.2 76.92,50.71 v76.77,50.86
  Route15 0.254: v41.4,52.45 37.97,55.88 | v34.16,57.02 35.31,55.88 37.97,55.88 | 37.97,55.88 38.1,55.88 41.91,59.69 v41.91,60.71 43.43,60.71 45.85,63.12 46.23,63.12 47.24,62.1 v47.24,61.98 49.4,59.82 v49.53,59.82 53.21,56.13 v53.21,56.01 51.31,54.1 v51.31,53.72 49.28,51.69 v49.28,51.05 47.12,48.9 v47.12,48.64 46.61,48.13 45.47,48.13 v44.96,48.64
  Bottom 0.254: C55.1 v41.91,60.71 | v41.4,52.45 41.45,52.45 C54.1 44.16,49.75 C66.1 44.96,49.08 v44.96,48.64 | C56.1 48.73,52.04 | 48.73,52.04 49.23,52.54 C52.1 | v49.28,51.05 49.28,51.5 48.73,52.04
  Bottom 0.406: v76.77,50.86 58.17,50.86 57.4,51.63 53.4,51.63 v51.31,53.72
+1V8  (via drill 0.35)
  Top 0.152: C38.2 57.28,52.32 v57.15,52.32 55.22,52.32 U$1.59 U$1.60 | U$1.60 | U$1.60 U$1.61 U$1.62 | U$1.62 | U$1.70 U$1.69 | U$1.69 | U$1.69 U$1.68 | U$1.68 | U$1.68 U$1.67 | U$1.67 | U$1.67 U$1.66 U$1.65 55.88,56.47 v55.88,55.88 | U$1.72 52.58,57.93 | 52.58,57.93 52.58,57.53 53.21,56.9 53.24,56.9 U$1.69 | U$1.69 55.27,58.93 v55.37,58.93 | U$1.79 50.67,59.98 50.67,59.56 52.31,57.93 52.58,57.93
  Top 0.254: v55.37,58.93 56.9,57.4 57.02,57.4 57.95,58.33 C39.1 C47.1
  Top 0.305: v78.49,69.15 78.74,69.41 R70.2
  Route15 0.152: v55.88,55.88 57.15,54.61 v57.15,52.32
  Bottom 0.152: 51.6,57.15 C50.1 52.45,57.78 54.23,57.78 v55.37,58.93
  Bottom 0.254: C51.1 51.6,57.3 51.6,57.15
  Bottom 0.305: 67.31,57.15 68.58,58.42 68.58,66.61 70.55,68.58 77.92,68.58 v78.49,69.15 | 67.31,57.15 C14.2 | 67.31,57.15 67.31,55.05 66.86,54.61 R13.2 65.62,53.81 65.47,53.66 61.59,53.66 61.52,53.73 60.46,53.73 60.01,53.28 57.59,53.28 57.15,52.83 v57.15,52.32
+2V5
  Top 0.254: JP3.1 72.39,35.31 72.77,35.69 73.79,35.69 74.11,36.01 75.48,36.01 C76.1 77.41,35.98 U$6.5
+3V3  (via drill 0.35)
  Top 0.152: v38.61,57.66 38.57,57.66 | 38.57,57.66 U$1.122 | U$1.127 37.01,56.39 37.34,56.39 38.57,57.62 38.57,57.66 | v43.69,61.98 43.56,62.1 43.56,62.87 42.77,63.66 U$1.104 | v46.48,63.75 46.52,63.75 U$1.93 | v48.77,61.59 48.89,61.59 U$1.85 51.98,64.68 C58.1 | v52.58,53.98 52.58,53.83 U$1.57 | v50.67,51.82 50.67,51.78 U$1.50 | U$1.109 40.39,63.19 v40.39,63.5
  Top 0.203: C32.2 40.41,29.11 40.73,28.79
  Top 0.254: C31.1 79.91,35.87 U$6.1 78.99,36.01 78.8,36.2 78.8,37.72 78.99,37.91 U$6.3 80.01,37.94 80.01,39.62 78.3,41.34 72.39,41.34 | R8.2 64.98,40.98 65.34,41.34 | 65.34,41.34 v65.72,41.34 72.39,41.34 | U1.3 65.41,41.4 65.34,41.34 | JP3.3 72.39,41.34 | U$8.1 34.43,9.86 | 34.43,9.86 34.73,10.16 34.73,11.66 C2.1 | 34.43,9.86 34.54,9.74 34.54,4.25 33.92,3.62 27.43,3.62 | J3.4 14.42,3.99 14.8,3.62 27.43,3.62 | 27.43,3.62 27.94,4.13 27.94,5.41 J3.31
  Top 0.305: C31.1 80.9,33.91 83.06,31.75 | JP10.1 87.63,31.11 87,31.75 83.06,31.75 | JP6.1 77.98,28.13 78.99,29.15 80.45,29.15 83.06,31.75 | U2.20 63.25,30.86 v63.06,30.67 62.23,29.84 C33.2 | v52.96,32.13 U3.20 51.37,30.86 50.93,30.42 | C35.2 50.93,30.42 | 50.93,30.42 v50.29,30.42 | U4.20 v41.53,29.59 40.73,28.79 40.73,26.83 40.39,26.49 40.25,26.49 36.81,23.05 35.88,23.05 | U6.1 35.88,23.05 | U5.1 35.81,19.08 | 35.81,19.08 35.84,19.08 36.13,19.37 36.13,21.34 35.88,21.59 35.88,23.05 | 35.81,19.08 35.81,17.72 36.45,17.08 R39.1 R38.1 33.49,15.46 32.64,14.61 32.64,12 32.96,11.68 C2.1
  Top 0.406: 62.87,50.55 v62.87,52.32 62.87,53.09 63.12,53.34 C1.1 | 62.87,50.55 U1.8 | U1.7 63.93,50.55 62.87,50.55 | 23.88,54.86 23.88,54.87 | 23.88,54.87 RN1.1 RN1.2 RN1.3 RN1.4 23.88,61.89 C3.1 C5.1 20.06,61.8 U$2.P$22 16.21,61.78 v8.57,61.78 | 23.88,54.87 23.88,54.48 | 23.88,54.48 23.88,53.34 R36.1 | v26.16,54.48 23.88,54.48 | v20.32,49.53 20.11,49.31 R9.1 16.23,49.31 16,49.09 13.04,49.09 | C6.1 13.01,47.76 13.02,47.76 C30.1 13.04,49.09 | U$2.P$9 12.21,49.09 13.04,49.09 | R19.2 13.69,68.03 v13.34,68.39 | v16.76,78.68 17.4,78.68 17.78,78.3 R2.2 R1.2 20.42,76.95 RN2.4 RN2.3 RN2.2 RN2.1 26.55,76.95 29.08,74.42 JP5.1 | R11.2 40.07,69.28 38.42,69.28 37.91,69.79 37.91,70.74 v38.61,71.44 | v71.69,90.49 71.69,92.77 J4.1 | v77.53,56.26 78.74,57.47 R69.2
  Route2 0.152: v40.39,63.5 41.02,63.5 43.12,61.4
  Route2 0.254: 45.72,64.52 45.21,64.52 44.2,63.5 44.2,62.48 v43.69,61.98 43.12,61.4 42.55,60.83 42.55,59.69 41.78,58.93 v41.78,57.78 | 45.72,64.52 v46.48,63.75 48.64,61.59 v48.77,61.59 53.98,56.39 53.98,55.5 52.58,54.1 v52.58,53.98 50.67,52.07 v50.67,51.82 | v46.74,67.56 45.72,66.55 45.72,64.52
  Route2 0.305: v63.06,30.67 54.42,30.67 v52.96,32.13
  Route2 0.406: v13.34,68.39 13.34,72.26 12.57,73.03 12.57,78.11 13.27,78.8 16.64,78.8 v16.76,78.68 16.76,80.58 19.24,83.06 21.46,83.06 21.84,83.44 v21.84,84.01 | JP1.1 72.39,88.84 71.69,89.53 v71.69,90.49
  Route15 0.254: v65.72,41.34 65.72,45.66 64.2,47.18 64.2,51.88 63.75,52.32 v62.87,52.32
  Route15 0.305: JP6.1 77.98,30.16 77.22,30.92 63.31,30.92 v63.06,30.67
  Route15 0.406: v62.87,52.32 60.96,50.42 56.13,50.42 v52.58,53.98 | JP1.1 72.39,74.23 73.6,73.03 73.6,63.82 73.98,63.44 76.2,63.44 78.68,60.96 78.68,57.53 77.53,56.39 v77.53,56.26
  Bottom 0.152: v38.61,57.66 38.61,57.4 | C59.1 v43.69,61.98
  Bottom 0.254: v50.67,51.82 52.96,49.53 54.61,49.53 C70.1 C57.1 | C60.1 v46.74,67.56 | v46.74,67.56 | C69.1 39.91,56.11 | 39.91,56.11 40.6,56.81 C61.1 41.71,57.78 v41.78,57.78 | 38.61,57.4 39.91,56.11
  Bottom 0.305: JP10.1 88.46,28.45 88.84,28.07 88.84,8.51 88.46,8.13 JP10.17 82.17,8.13 81.6,7.56 78.11,7.56 77.98,7.43 JP6.17 | v50.29,30.42 47.88,30.42 46.86,29.4 41.72,29.4 v41.53,29.59
  Bottom 0.406: v62.87,52.32 65.98,52.32 68.26,54.61 JP1.17 72.39,55.37 72.96,55.94 77.22,55.94 v77.53,56.26 | C69.1 38.48,55.88 29.72,55.88 28.32,54.48 v26.16,54.48 25.27,54.48 v20.32,49.53 | R10.2 v8.57,61.78 8.57,61.91 10.03,63.37 11.87,63.37 13.34,64.83 v13.34,68.39 | v21.84,84.01 21.84,88.52 21.59,88.77 J1.4 21.59,91.69 20.83,92.46 20.83,98.03 C9.1 | JP5.1 39.5,74.42 | 39.5,74.42 43.18,74.42 45.47,76.71 L2.1 | 39.5,74.42 39.5,72.33 v38.61,71.44 38.04,70.87 38.04,69.79 38.61,69.22 39.88,69.22 R32.1
+3V3A  (via drill 0.35)
  Top 0.152: U$1.76 53.31,60.92 54.05,60.92 54.35,61.22 | 54.35,61.22 C71.1 | U$1.115 38.97,61.21 38.35,61.21 37.97,61.59 37.52,61.59 C16.2 37.27,63.11 37.27,63.5 35.25,65.52 v35.25,66.17 33.73,67.69 29.97,67.69 28.51,69.15 19.49,69.15 16.51,72.14 16.51,73.03 13.08,76.45 v4.83,76.45 | v54.29,61.16 54.35,61.22
  Top 0.254: C37.1 84.67,38.08 80.58,42.16 v78.42,42.16
  Top 0.406: C37.1 87.64,36.83 IC1.2
  Route15 0.254: v78.42,42.16 67.88,42.16 66.1,40.39 58.67,40.39 53.09,45.97 45.72,45.97 43.18,48.51 43.18,48.9 48.18,53.9 v48.18,60.25
  Bottom 0.152: R30.2 C26.2 4.61,76.67 v4.83,76.45 | v35.25,66.17 35.93,66.17 R29.2
  Bottom 0.254: v48.18,60.25 48.26,60.33 | v48.18,60.25 48.51,60.58 50.23,60.58 51.56,59.24 52.38,59.24 v54.29,61.16 | R29.2 37.66,66.04 37.97,66.04 39.69,64.33 41.4,64.33 43.05,62.67 44.96,62.67 47.38,60.25 v48.18,60.25
+5V  (via drill 0.35)
  Top 0.152: 23.62,88.45 X1.VBUS
  Top 0.254: U$13.1 6.58,16.74 6.67,16.83 8.32,16.83 8.45,16.7 8.45,15.93 U$13.3 8.53,15.94 10.35,15.94 | U$14.1 3.87,10.77 | 3.87,10.77 3.04,10.77 C84.1 | R57.1 40.26,19.82 40.58,20.13 40.58,23.74 | 40.58,23.74 R58.1 | 40.58,23.74 v40.58,25.91 | v84.71,33.34 84.71,34.51 C36.1 | v17.84,15.94 10.35,15.94 | v10.35,15.11 10.35,15.94 | v4,11.94 4,10.89 3.87,10.77 | X1.VBUS 23.82,90.48 23.24,91.06 22.1,91.06 21.4,91.76 21.4,93.53 21.62,93.76 U$15.1
  Top 0.406: C44.1 U$13.1 | C36.1 87.67,34.54 IC1.3 | X1.VBUS 23.82,84.19 26.54,81.47 28.13,81.47 v28.19,81.53
  Top 0.508: IC1.3 90.46,34.65 91,35.18 91,50.55 96.14,55.69 | R16.2 v75.88,78.68
  Top 0.813: U$7.2 93.23,81.71 93.85,81.09 95.31,81.09 | 95.31,81.09 97.75,81.09 U$10.P$2 | U$4.P$2 96.18,68.35 95.38,69.15 | 95.38,69.15 95.38,81.03 95.31,81.09 | 95.38,69.15 95.38,56.45 96.14,55.69 97.75,55.69 U$11.P$2
  Route2 0.254: v60.9,34.8 69.15,34.8 71.44,32.51 83.95,32.51 84.71,33.27 v84.71,33.34
  Route2 0.406: v28.19,81.53 29.15,82.49 29.15,84.58 30.35,85.79 34.54,85.79 36.26,87.5 47.31,87.5 51.82,83 55.12,83 55.94,82.17 55.94,79.63 v56.2,79.38
  Bottom 0.254: C73.1 12.07,12.06 11.6,12.53 U$9.4 10.35,13.21 | v60.9,34.8 50.29,34.8 48.39,32.89 43.88,32.89 40.58,29.59 v40.58,25.91 39.56,25.91 38.23,24.57 38.23,22.92 36.26,20.95 34.42,20.95 31.43,17.97 28.64,17.97 25.97,15.3 18.48,15.3 v17.84,15.94 | 10.35,13.21 v10.35,15.11 U$9.6 | 10.35,13.21 5.27,13.21 v4,11.94
  Bottom 0.406: v10.35,15.11 10.35,20.07 10.51,20.23 | 10.51,20.23 10.67,20.38 L1.P$1 | Q4.1 8.81,21.92 10.51,20.23 | v56.2,79.38 58.1,77.47 68.45,77.47 69.6,76.33 74.87,76.33 74.93,76.26
  Bottom 0.508: U$10.P$2 97.77,81.03 88.96,81.03 86.61,78.68 v75.88,78.68 75.88,77.22 74.93,76.26 JP1.2 JP1.4
ADV7611_1V8  (via drill 0.35)
  Top 0.203: v16.07,26.86 14.58,26.86 U$5.14 | U$5.2 15.61,32.88 15.62,32.89 16.07,32.45 v17.78,32.45 18.67,33.34 18.67,33.97 18.61,34.04 | U$5.60 18.48,34.16 18.61,34.04 | U$5.52 v22.48,34.04 19.98,34.04 | 19.98,34.04 18.61,34.04 | U$5.57 19.98,34.04 | v24.26,29.08 24.56,29.38 U$5.40 | v20.19,25.97 19.98,25.76 U$5.24
  Top 0.254: U$14.5 9.25,10.77 C45.1 9.38,12.11 v9.65,12.38
  Route15 0.203: v22.61,31.62 24.26,29.97 v24.26,29.08 24.26,27.18 22.92,25.84 20.32,25.84 v20.19,25.97 17.72,25.97 16.83,26.86 | 16.83,26.86 v16.07,26.86 | 16.83,26.86 16.83,31.81 17.46,32.45 v17.78,32.45
  Route15 0.254: v9.65,12.38 10.92,12.38 11.68,13.14 11.68,20.45 16.07,24.83 v16.07,26.86
  Bottom 0.203: C46.1 15.65,26.45 v16.07,26.86 | v22.48,34.04 22.5,34.04 C79.1 22.5,31.8 22.61,31.69 v22.61,31.62 | C77.1 24.02,28.84 v24.26,29.08 | C78.1 17.72,31.5 17.72,32.45 v17.78,32.45
ADV7611_3V3  (via drill 0.35)
  Top 0.152: U$5.56 20.48,36.67 v20.7,36.89
  Top 0.203: U$5.11 15.81,28.38 v15.88,28.32 | U$5.8 15.84,29.88 v15.88,29.84 | U$5.5 15.73,31.38 v15.88,31.24 | v19.37,25.34 19.48,25.22 U$5.23 | v24.51,26.29 24.61,26.38 U$5.34 | v24.45,31.37 25.89,31.37 U$5.44
  Top 0.254: C43.1 7.46,21.75 8.26,22.54 12.13,22.54 14.54,24.96 15.56,24.96 17.21,26.61 17.21,28.07 16.95,28.32 v15.88,28.32 | v24.45,31.37 24.07,31.75 24.07,33.47 v25.84,35.24 26.16,35.56 28.26,35.56 30.16,37.47 30.16,39.62 29.74,40.04 R65.1 R67.2
  Top 0.406: C43.1 7.53,20.73 U$13.5 7.53,17.88 7.05,17.4 6.29,17.4 5.49,18.2 R68.2
  Route2 0.203: v15.88,31.24 v15.88,29.84 v15.88,28.32 15.88,27.88 16.7,27.05 16.7,25.34 v19.37,25.34 24.19,25.34 24.51,25.65 v24.51,26.29 24.51,28.38 24.96,28.83 24.96,30.86 v24.45,31.37
  Bottom 0.152: v20.7,36.89 24.19,36.89 v25.84,35.24
  Bottom 0.203: C83.1 24.4,26.4 v24.51,26.29 | v19.37,25.34 18.91,25.8 C81.1 | C80.1 15.54,28.66 v15.88,28.32 | C82.1 15.45,30.82 v15.88,31.24
CEC  (via drill 0.35)
  Top 0.152: U$12.P$13 9.04,32.15 9.78,32.89 v10.92,32.89 | v18.03,33.53 arc-90 17.98,33.58 U$5.61
  Route2 0.152: v10.92,32.89 17.27,32.89 17.91,33.53 v18.03,33.53
CSI_D0/LCD_D2  (via drill 0.35)
  Top 0.152: U$1.33 47.88,44.95 47.88,44.51 46.48,43.12 v46.48,41.53 | v67.44,26.8 67.64,26.59 U2.6 | U$5.33 27.41,25.88 v27.5,25.97 | J3.23 23.92,8.56 31.62,16.26 v31.62,17.02
  Route2 0.152: v46.48,41.53 46.48,37.59 55.37,28.7 61.72,28.7 63.75,26.67 67.31,26.67 v67.44,26.8
  Route15 0.152: v27.5,25.97 32.58,25.97 | 32.58,25.97 35.5,28.89 35.5,31.56 40.13,36.2 40.13,37.85 41.08,38.8 41.08,39.75 42.86,41.53 v46.48,41.53 | v31.62,17.02 31.62,23.11 32.7,24.19 32.7,25.84 32.58,25.97
CSI_D1/LCD_D3  (via drill 0.35)
  Top 0.152: v69.09,26.42 68.94,26.26 U2.8 | U$5.32 23.98,22.82 24.32,22.48 32.38,22.48 | 32.38,22.48 33.78,23.88 36.2,23.88 v36.58,24.26 | U$1.32 43.29,44.69 43.29,44.58 42.16,43.45 42.16,42.61 v44.74,40.04 | J3.24 24.42,6.69 24.26,6.86 24.26,8.26 32.38,16.38 32.38,22.48
  Route2 0.152: v69.09,26.42 68.9,26.23 63.5,26.23 61.47,28.26 55.05,28.26 45.97,37.34 45.97,39.43 45.34,40.07 44.77,40.07 v44.74,40.04
  Route15 0.152: v36.58,24.26 40.2,24.26 42.23,26.29 42.23,29.02 43.05,29.84 44.32,29.84 45.21,30.73 45.21,39.56 v44.74,40.04 44.64,40.13
CSI_D2/LCD_D4  (via drill 0.35)
  Top 0.152: U$1.31 42.99,44.95 42.99,44.7 41.47,43.18 41.47,42.23 v42.93,40.77 44.26,39.43 59.5,39.43 62.99,35.94 65.53,35.94 66.8,34.67 68.71,34.67 70.23,33.15 U2.11 v70.23,29.46 | U$5.31 23.48,22.32 v23.76,22.04 | v24.89,7.11 arc-90 24.92,7.08 J3.25 | v35.85,25.93 34.81,24.88 34.62,24.7 32.45,24.7 30.86,23.11 v27.43,23.11
  Route2 0.152: v23.76,22.04 23.48,22.04 23.47,22.05 20.21,22.05 18.8,20.64 18.8,12.26 23.43,7.62 24.57,7.62 24.89,7.3 v24.89,7.11 | JP10.20 90.17,6.73 90.04,6.86 84.96,6.86 84.33,7.49 84.33,26.48 81.72,29.08 70.61,29.08 v70.23,29.46
  Route15 0.152: v42.93,40.77 41.4,39.24 41.4,38.61 40.64,37.85 40.64,36.07 36.32,31.75 36.32,26.4 v35.85,25.93
  Bottom 0.152: v23.76,22.04 26.17,22.04 27.24,23.11 v27.43,23.11
CSI_D3/LCD_D5  (via drill 0.35)
  Top 0.152: U$1.30 42.67,45.2 42.67,44.9 40.8,43.02 | 40.8,43.02 40.51,42.74 40.51,42.1 43.56,39.05 59.24,39.05 62.8,35.5 65.34,35.5 66.55,34.29 68.52,34.29 68.96,33.85 68.96,30.89 U2.13 68.94,29.62 v68.96,29.59 | U$5.30 22.98,21.82 v23.26,21.55 | v40.8,42.83 40.8,43.02 | J3.26 25.42,7.6 v25.21,7.81
  Route2 0.152: v23.26,21.55 20.41,21.55 19.3,20.43 19.3,12.38 23.69,8 25.02,8 v25.21,7.81 | JP10.19 84.64,5.59 83.57,6.67 83.57,26.35 81.41,28.51 70.04,28.51 v68.96,29.59
  Bottom 0.152: v23.26,21.55 23.54,21.55 23.55,21.54 29.03,21.54 36.32,28.83 36.32,28.96 36.32,31.43 40.64,35.75 40.64,37.78 41.4,38.54 41.4,39.69 40.89,40.2 40.7,40.2 39.69,41.21 39.69,41.66 40.8,42.77 v40.8,42.83
CSI_D4/LCD_D6  (via drill 0.35)
  Top 0.152: U$1.28 42.22,45.87 42.22,44.96 39.81,42.56 39.81,41.91 v40.67,41.05 43.05,38.67 59.05,38.67 62.67,35.05 65.28,35.05 66.42,33.91 67.37,33.91 67.63,33.66 67.63,30.87 U2.15 67.63,30.85 67.63,29.65 67.5,29.53 v67.5,28.45 | U$5.29 22.48,21.33 v22.79,21.01 | v25.84,8.26 25.92,8.18 J3.27 | JP6.16 81.66,8.89 82.17,9.4 89.79,9.4 90.17,9.78 JP10.16
  Route2 0.152: v22.79,21.01 v22.79,21.02 20.32,21.02 19.81,20.51 19.81,12.51 23.81,8.51 25.59,8.51 v25.84,8.26 | v67.5,28.45 67.5,27.94 67.94,27.5 69.47,27.5 71.69,25.27 71.69,24.88 v71.93,24.64
  Route15 0.152: v71.93,24.64 73.77,22.8 81.22,22.8 81.92,22.1 81.92,9.27 81.53,8.89 JP6.16
  Bottom 0.152: v22.79,21.01 29.4,21.01 37.08,28.7 37.08,31.37 41.27,35.56 41.27,37.59 41.91,38.23 41.91,39.81 v40.67,41.05
CSI_D5/LCD_D7  (via drill 0.35)
  Top 0.152: U$1.27 41.91,46.13 41.91,45.09 39.12,42.29 39.12,41.59 42.48,38.23 42.86,38.23 | 42.86,38.23 58.8,38.23 62.42,34.61 65.02,34.61 66.34,33.29 U2.17 66.36,30.85 v66.36,29.15 | v42.84,38.06 42.84,38.2 42.86,38.23 | U$5.28 21.98,20.83 v22.39,20.42 | J3.28 26.42,8.68 v26.38,8.72 | JP6.15 77.98,9.97 78.17,10.16 81.92,10.16 82.42,10.67 JP10.15
  Route2 0.152: v26.38,8.72 26.21,8.89 24.07,8.89 20.32,12.64 20.32,20.13 20.7,20.51 22.3,20.51 v22.39,20.42
  Route15 0.152: v66.36,29.15 66.36,28.38 67.12,27.62 69.79,27.62 72.07,25.34 81.34,25.34 82.49,24.19 82.49,8.06 82.17,7.75 78.17,7.75 77.98,7.94 JP6.15
  Bottom 0.152: v42.84,38.06 42.1,37.32 42.1,35.37 37.78,31.05 37.78,28.57 29.63,20.42 v22.39,20.42
CSI_D6/LCD_D10  (via drill 0.35)
  Top 0.152: U$1.24 41.2,47.12 39.94,47.12 38.92,46.1 v38.92,45.97 | v54.04,27.75 55.94,27.75 56.21,27.48 v56.21,26.29 U3.6 | U$5.27 21.48,20.33 v21.98,19.83 | v19.43,7.11 19.92,6.62 J3.15 | JP6.14 81.53,11.43 81.98,11.87 89.66,11.87 90.17,12.38 JP10.14
  Route2 0.152: v38.92,45.97 38.92,43.75 47.69,34.99 | 47.69,34.99 51.88,30.8 51.88,28.38 52.51,27.75 v54.04,27.75 | v47.49,34.98 47.68,34.98 47.69,34.99 | v56.21,26.29 56.2,26.28 56.2,23.5 58.1,21.59 59.63,21.59 62.48,18.73 v62.48,17.84 | v72.26,13.02 71.44,13.02 68.39,16.06 v66.42,16.06
  Route15 0.152: v21.98,19.83 20.27,19.83 19.43,18.99 v19.43,7.11 | v66.42,16.06 65.72,16.06 64.01,17.78 62.55,17.78 v62.48,17.84
  Bottom 0.152: v47.49,34.98 42.6,34.98 38.54,30.92 38.54,27.88 35.12,24.45 34.73,24.45 30.11,19.83 v21.98,19.83 | JP6.14 80.52,12.57 80.39,12.7 76.77,12.7 76.33,13.14 72.39,13.14 v72.26,13.02
CSI_D7/LCD_D11  (via drill 0.35)
  Top 0.152: U$1.23 41.08,47.56 39.43,47.56 37.97,46.1 v37.97,45.78 | U3.8 57.51,26.01 57.91,26.42 57.91,27.05 v57.53,27.43 | U$5.26 20.98,19.72 v21.53,19.18 | v20.06,7.48 20.42,7.12 J3.16 | JP6.13 77.98,12.51 78.23,12.76 81.66,12.76 82.04,13.14 87.57,13.14 JP10.13
  Route2 0.152: v37.97,45.78 37.97,42.74 40.2,40.51 41.15,40.51 47.88,33.78 v48.01,33.78 51.05,30.73 51.05,28.19 52.13,27.11 56.52,27.11 56.83,27.43 v57.53,27.43 58.04,26.92 58.04,24.26 58.36,23.94 70.23,23.94 v70.48,23.69
  Route15 0.152: v21.53,19.18 20.32,19.18 20,18.86 20,7.43 | 20,7.37 20,7.43 | 20,7.43 v20.06,7.48 | JP6.13 76.58,11.43 73.53,14.48 73.53,15.37 72.58,16.32 71.63,16.32 v71.12,16.83
  Bottom 0.152: v48.01,33.78 47.62,34.16 42.86,34.16 39.24,30.54 39.24,28.07 30.35,19.18 v21.53,19.18 | v70.48,23.69 71.12,23.05 v71.12,16.83
CSI_D8/LCD_D12  (via drill 0.35)
  Top 0.152: U$1.22 40.96,48.01 39.13,48.01 37.09,45.97 37.09,42.67 v37.27,42.48 42.35,37.4 47.75,37.4 51.18,33.97 58.29,33.97 58.8,33.47 v58.8,32.26 U3.11 58.86,30.92 | U$5.43 30.5,30.88 v30.61,30.99 | J3.17 20.92,8.67 25.97,13.72 25.97,14.92 26.42,15.37 29.91,15.37 30.29,15.75 v30.35,15.75 | JP6.12 81.92,13.97 82.3,14.35 89.72,14.35 90.17,14.8 JP10.12
  Route2 0.152: v30.35,15.75 31.05,16.45 31.05,23.05 32.26,24.26 32.26,29.97 31.24,30.99 v30.61,30.99
  Route15 0.152: v58.8,32.26 58.67,32.13 58.67,23.75 60.07,22.35 61.09,22.35 v61.34,22.1
  Bottom 0.152: v30.61,30.99 31.75,30.99 32.07,31.3 32.07,32.83 33.66,34.42 33.66,38.42 36.13,40.89 36.13,41.34 v37.27,42.48 | JP6.12 80.52,15.05 80.33,15.24 73.72,15.24 72.83,16.13 68.9,16.13 66.99,18.03 64.14,18.03 61.34,20.83 v61.34,22.1
CSI_D9/LCD_D13  (via drill 0.35)
  Top 0.152: U$1.18 36.62,45.93 | 36.62,45.93 36.58,45.89 | 36.62,45.93 36.62,42.18 v37.34,41.47 41.91,36.89 47.5,36.89 50.86,33.53 57.02,33.53 57.47,33.08 57.47,30.9 U3.13 57.47,30.82 v57.47,29.65 | U$5.42 30.39,30.38 v30.54,30.23 | J3.18 21.42,8.53 26.8,13.91 v26.8,14.67 | JP6.11 77.98,15.05 78.17,15.24 81.79,15.24 82.23,15.68 87.57,15.68 JP10.11
  Route2 0.152: v26.8,14.67 26.8,15.68 27.05,15.94 29.59,15.94 30.48,16.83 30.48,23.37 31.81,24.7 31.81,29.84 31.43,30.23 v30.54,30.23
  Bottom 0.152: v30.54,30.23 32.13,30.23 32.51,30.61 32.51,32.51 34.1,34.1 34.1,38.04 34.67,38.61 34.67,38.8 v37.34,41.47 | v57.47,29.65 57.47,29.08 60.71,25.84 60.71,20.7 63.88,17.53 66.74,17.53 70.55,13.72 72.45,13.72 72.71,13.97 JP6.11
CSI_D10/LCD_D14  (via drill 0.35)
  Top 0.152: U$1.17 36.07,45.95 36.07,41.66 v37.24,40.48 41.27,36.45 47.31,36.45 50.61,33.15 55.88,33.15 56.2,32.83 56.2,30.87 | 56.2,30.87 U3.15 | U$5.41 30.06,29.88 v30.48,29.46 | J3.19 21.92,8.27 27.62,13.97 v27.62,14.73 | v56.07,29.4 56.2,29.53 56.2,30.87 | JP6.10 81.41,16.51 81.92,17.02 89.72,17.02 90.17,17.46 JP10.10
  Route2 0.152: v30.48,29.46 30.99,29.46 31.3,29.15 31.3,24.89 29.84,23.43 v29.84,17.08
  Route15 0.152: v27.62,14.73 27.62,16.26 27.81,16.45 29.53,16.45 29.53,16.76 v29.84,17.08 | v56.07,29.4 55.37,28.7 55.37,24.89 55.94,24.32 56.52,24.32 59.56,21.27 71.69,21.27 72.64,20.32 78.8,20.32 79.25,19.88 79.25,16.64 79.44,16.45 80.45,16.45 JP6.10
  Bottom 0.152: v30.48,29.46 30.67,29.27 32.32,29.27 32.96,29.91 32.96,32.26 34.61,33.91 34.61,37.47 35.18,38.04 35.18,38.42 v37.24,40.48
CSI_D11/LCD_D15  (via drill 0.35)
  Top 0.152: 54.86,30.91 U3.17 54.93,30.87 | 54.93,30.87 54.93,32.58 54.74,32.77 50.42,32.77 47.12,36.07 40.7,36.07 v37.4,39.37 35.31,41.47 35.31,45.75 U$1.16 | U$5.39 30,28.88 v30.16,28.72 | J3.20 22.42,7.88 28.7,14.16 v28.7,14.73 | v55.19,29.6 54.93,29.86 54.93,30.87 | v61.34,18.92 61.34,16.76 62.55,15.56 68.2,15.56 70.1,13.65 72.96,13.65 75.82,16.51 JP6.9 77.98,17.65 78.23,17.91 81.85,17.91 82.23,18.29 JP10.9
  Route2 0.152: v30.16,28.72 30.73,28.15 30.73,25.08 29.34,23.69 29.34,18.03 28.7,17.4 v28.7,16.95
  Route15 0.152: v55.19,29.6 54.67,29.08 54.67,24.57 56.2,23.05 56.2,21.14 56.9,20.45 59.82,20.45 v61.34,18.92 61.4,18.86
  Bottom 0.152: v30.16,28.72 32.53,28.72 33.4,29.59 33.4,32 35.05,33.66 35.05,37.02 v37.4,39.37 | v28.7,16.95 v28.7,14.73
CSI_D12/LCD_D18  (via drill 0.35)
  Top 0.152: U4.6 44.78,27.99 44.58,28.19 44.51,28.19 v44.45,28.26 | U$1.15 34.67,45.68 34.67,41.02 37.27,38.42 v37.27,38.35 | U$5.38 29.36,28.38 v29.53,28.21 | J3.7 15.92,8.87 18.29,11.24 19.05,11.24 22.86,15.05 22.86,17.65 v23.11,17.91
  Route2 0.152: v44.45,28.26 44.39,28.26 43.69,28.96 43.69,36.13 43.31,36.51 39.69,36.51 37.85,38.35 v37.27,38.35 | v23.11,17.91 24.32,19.11 24.32,24.64 25.34,25.65 25.34,27.88 25.78,28.32 29.42,28.32 v29.53,28.21
  Bottom 0.152: v29.53,28.21 32.59,28.21 33.91,29.53 33.91,31.94 35.5,33.53 35.5,36.2 36.77,37.47 36.77,37.85 v37.27,38.35
CSI_D13/LCD_D19  (via drill 0.35)
  Top 0.152: U4.8 46.08,26.57 46.02,26.62 v46.02,27.05 | U$1.14 34.29,45.86 34.29,40.39 35.5,39.18 35.69,39.18 v37.4,37.47 | U$5.37 28.74,27.88 v28.91,27.71 | J3.8 16.42,8.68 18.48,10.73 19.37,10.73 23.3,14.67 23.3,17.02 v23.62,17.34
  Route2 0.152: v46.02,27.05 45.39,27.69 43.81,27.69 43.18,28.32 43.18,35.69 42.93,35.94 38.92,35.94 v37.4,37.47 | v23.62,17.34 24.89,18.61 24.89,24.45 25.84,25.4 25.84,27.56 25.99,27.71 v28.91,27.71
  Bottom 0.152: v28.91,27.71 32.79,27.71 34.54,29.46 34.54,32 36.01,33.47 36.01,35.88 37.02,36.89 37.02,37.08 v37.4,37.47
CSI_D14/LCD_D20  (via drill 0.35)
  Top 0.152: U4.11 47.37,33.66 45.47,35.56 38.1,35.56 v37.37,36.29 33.78,39.88 33.78,45.92 U$1.13 | U$5.36 28.24,27.38 v28.45,27.18 | J3.9 16.92,8.54 18.61,10.22 19.49,10.22 23.75,14.48 23.75,16.51 24.04,16.8 v24.09,16.8
  Route2 0.152: v24.09,16.8 25.4,18.12 25.4,24.38 26.35,25.34 26.35,27.11 26.61,27.37 28.26,27.37 v28.45,27.18
  Bottom 0.152: v28.45,27.18 33.02,27.18 34.92,29.08 34.92,31.69 36.51,33.27 36.51,35.43 v37.37,36.29
CSI_D15/LCD_D21  (via drill 0.35)
  Top 0.152: U4.13 46.08,33.93 44.96,35.05 37.78,35.05 v37.43,35.4 33.08,39.75 33.08,46.35 U$1.11 | U$5.35 27.58,26.88 v27.84,26.63 | J3.10 17.42,8.21 18.92,9.72 19.81,9.72 24.19,14.1 24.19,15.75 24.19,15.81 24.19,15.91 v24.49,16.21
  Route2 0.152: v24.49,16.21 25.91,17.63 25.91,24.13 26.73,24.96 26.73,26.48 26.88,26.63 v27.84,26.63
  Bottom 0.152: v27.84,26.63 33.23,26.63 35.56,28.96 35.56,31.5 37.43,33.37 v37.43,35.4
CSI_HSYNC/LCD_HSYNC  (via drill 0.35)
  Top 0.152: U$1.35 48.83,45.13 48.83,43.05 48.38,42.6 v47.82,42.6 | v34.99,21.84 34.99,21.15 U6.2 34.94,21.14 33.15,21.14 32.83,20.83 32.83,16.19 28.42,11.79 J3.32 | v29.65,34.1 27.94,32.38 U$5.46 | JP6.6 81.03,22.1 89.72,22.1 90.23,22.61 90.17,22.67 JP10.6
  Route2 0.152: v34.99,21.84 34.99,28.77 v29.65,34.1 | v72.58,15.24 74.74,17.4 74.74,19.68 75.25,20.19 79.18,20.19 80.52,21.53 JP6.6
  Route15 0.152: v47.82,42.6 41.52,42.6 41.21,42.29 40.07,42.29 38.92,43.43 34.54,43.43 32.26,41.15 32.26,36.7 v29.65,34.1 | v34.99,21.84 36.7,21.84 42.16,16.38 60.71,16.38 61.98,15.11 72.45,15.11 v72.58,15.24
CSI_MCLK/LCD_DE  (via drill 0.35)
  Top 0.152: U$1.36 49.21,45.32 49.21,42.74 48.57,42.1 48.02,42.1 v47.82,41.9 | U$5.45 28.52,31.88 v28.77,32.13 | J3.34 29.42,11.26 v29.65,11.49 | JP6.8 81.34,19.05 81.72,19.43 88.01,19.43 89.41,20.83 JP10.8
  Route15 0.152: v47.82,41.9 47.62,42.1 47.61,42.1 47.6,42.1 42.04,42.1 41.72,41.78 39.81,41.78 38.54,43.05 35.05,43.05 32.64,40.64 32.64,38.1 32.96,37.78 32.96,36.32 v28.77,32.13 28.51,31.88 27.43,31.88 26.61,31.05 26.61,25.34 26.73,25.21 29.84,25.21 30.67,24.38 30.67,16.57 31.18,16.07 31.18,13.02 v29.65,11.49
  Bottom 0.152: v47.82,41.9 48.02,42.1 48.32,42.39 48.32,42.4 48.47,42.55 49.91,42.55 54.29,38.16 64.01,38.16 74.61,27.56 74.61,18.41 75.12,17.91 79.95,17.91 80.52,18.48 JP6.8
CSI_PCLK/LCD_CLK  (via drill 0.35)
  Top 0.152: U$5.25 20.48,19.23 v21.09,18.61 | v49.97,43.43 49.97,43.75 49.66,44.07 49.66,45.44 U$1.37 | v27.43,6.73 v27.42,6.72 J3.30 | JP6.7 77.98,20.13 78.17,20.32 81.41,20.32 81.92,20.83 JP10.7
  Route2 0.152: v21.09,18.61 27.43,12.27 v27.43,6.73
  Route15 0.152: v40.58,30.8 40.58,31.37 43.88,34.67 43.88,40.58 44.2,40.89 47.94,40.89 49.97,42.93 v49.97,43.43
  Bottom 0.152: v21.09,18.61 30.81,18.61 35.31,23.11 36.58,23.11 37.34,23.88 37.34,25.15 39.88,27.69 39.88,30.29 40.39,30.8 v40.58,30.8 | v49.97,43.43 54.55,38.86 64.52,38.86 75.31,28.07 75.31,19.68 75.95,19.05 JP6.7
CSI_VSYNC/LCD_VSYNC  (via drill 0.35)
  Top 0.152: U$1.34 48.32,45.07 48.32,43.43 48.2,43.31 v47.82,43.31 | U$5.47 27.3,32.88 v28.64,34.23 | v34.92,17.97 34.95,17.95 U5.2 33.34,17.15 33.21,17.02 33.21,15.94 28.92,11.65 J3.33 | v71.82,14.48 72.96,14.48 75.06,16.57 75.06,20.19 76.45,21.59 JP6.5 77.98,22.54 78.3,22.86 81.15,22.86 81.66,23.37 JP10.5
  Route2 0.152: v34.92,17.97 34.92,19.11 33.97,20.07 33.97,28.89 v28.64,34.23
  Route15 0.152: v47.82,43.31 41.04,43.31 40.4,43.94 34.16,43.94 31.56,41.34 31.56,37.15 v28.64,34.23 | v34.92,17.97 36.96,17.97 39.18,15.75 60.45,15.75 61.72,14.48 v71.82,14.48
EN_1V8
  Top 0.254: U$14.3 6.01,8.87 6.29,9.14 6.29,11.49 4.61,13.17 R68.1
  Top 0.406: R68.1 C42.1
EPHY_RXN
  Top 0.152: U$1.89 50.04,65.01 50.04,71.12 42.99,78.17 40.45,78.17 38.86,79.76 38.86,82.04 U$3.6
  Bottom 0.152: R41.1 39.03,86.77 39.69,86.1 U$3.6
EPHY_RXP
  Top 0.152: U$1.90 49.66,65.19 49.66,70.87 42.8,77.72 40.07,77.72 38.42,79.38 38.42,83.69 38.92,84.2 43.37,84.2 43.56,84.39 43.49,84.46 U$3.3
  Bottom 0.152: R40.1 44.03,85.95 U$3.3
EPHY_TXN
  Top 0.152: U$1.91 49.28,65.38 49.28,70.61 43.18,76.71 38.02,76.71 35.9,78.83 35.9,85.94 37.03,87.07 44.2,87.07 44.77,86.5 U$3.2
  Bottom 0.152: R43.1 44.92,83.02 U$3.2
EPHY_TXP
  Top 0.152: U$1.92 48.9,65.56 48.9,70.48 43.18,76.2 38.1,76.2 35.56,78.74 35.56,86.11 36.83,87.38 44.96,87.38 46.03,86.3 U$3.1
  Bottom 0.152: R42.1 46.81,86.19 U$3.1
GND  (via drill 0.35)
  Top 0.152: U$15.5 19.02,95.46
  Top 0.254: J3.13 18.92,4.51 v19.18,4.25 | J3.21 22.92,4.51 v23.18,4.25 | J3.5 14.92,4.51 v15.18,4.25
  other vias: 26.92,4.32 30.42,4.32 37.59,10.67 38.8,8.32 51.82,21.59 70.93,24.77 66.23,27.24 42.86,58.36 46.23,49.78 47.31,50.61 39.43,45.47 60.71,90.93 63.75,90.93 66.8,90.93 9.21,25.4 62.87,54.55 58.61,62.1 60.01,60.58 61.98,58.61 56.52,46.1 58.8,48.01
  pour Bottom: 0,100.08 0,0 5.84,0 100.08,0 100.08,12.95 100.08,100.08 92.71,100.08
  pour Top: 0,100.08 0,0 8.64,0 100.08,0 100.08,12.19 100.08,100.08 98.81,100.08
  pour Route2: 0,100.08 0,0 3.05,0 100.08,0 100.08,5.84 100.08,100.08 84.84,100.08
  pour Route15: 0,99.82 0,0 4.06,0 100.08,0 100.08,9.65 100.08,100.08 97.54,100.08 0,100.08
HDMI_5V  (via drill 0.35)
  Top 0.152: 11.94,38.23 R61.1 11.91,34.68 11.94,34.65 | v3.49,33.85 5.21,33.85 6.02,34.65 U$12.P$18 11.94,34.65 | 11.94,34.65 15.22,34.65 15.88,35.31 U$5.64
  Bottom 0.152: R64.1 2.57,32.71 R63.1 2.6,33.78 | 2.6,33.78 R60.2 | v3.49,33.85 2.66,33.85 2.6,33.78
  Bottom 0.203: R66.1 1.33,20.64 2.03,21.34 3.56,21.34 3.81,21.59 3.81,28.13 2.57,29.37 R64.1
HDMI_SCL  (via drill 0.35)
  Top 0.152: U$5.62 17.48,33.61 17.27,33.4 16.13,33.4 15.62,33.91 11.05,33.91 10.79,33.66 10.03,33.66 9.53,33.15 U$12.P$15 6.61,33.15 5.84,32.38 5.84,31.37 v5.33,30.86
  Bottom 0.152: R64.2 5.09,30.62 v5.33,30.86
HDMI_SDA  (via drill 0.35)
  Top 0.152: 15.88,34.21 10.92,34.21 10.68,33.97 9.65,33.97 9.33,33.65 U$12.P$16 6.29,33.65 v5.4,32.77 | 15.88,34.21 15.89,34.21 | 16.95,35.28 U$5.63 16.98,34.06 16.7,33.78 16.31,33.78 15.88,34.21
  Bottom 0.152: v5.4,32.77 5.37,32.74 R63.2
HOTPLUG  (via drill 0.35)
  Top 0.152: U$12.P$19 9.18,35.15 v9.21,35.18 | v12.06,33.4 12.08,33.38 U$5.1 | v4.64,36.07 4.7,36.01 4.7,35.15
  Top 0.203: v4.64,19.24 4.06,19.81 4.06,29.21 2.41,30.86 2.41,34.35 3.21,35.15 4.7,35.15 U$12.P$19
  Bottom 0.152: v9.21,35.18 10.29,35.18 v12.06,33.4 | R60.1 4.31,35.75 v4.64,36.07
  Bottom 0.203: Q5.3 5.4,18.48 v4.64,19.24
HP_COM  (via drill 0.35)
  Top 0.152: v4.57,72.77 3.2,72.77 J2.RING2 | U$1.125 35.83,58.69 35.33,58.69 v35.31,58.67 | v24.64,66.8 24.38,67.06 19.05,67.06 14.48,71.63 v10.03,71.63
  Bottom 0.152: 6.35,72.77 C18.2 7.07,71.59 7.66,72.18 9.48,72.18 v10.03,71.63 | 6.35,72.77 v4.57,72.77 | R26.2 6.35,74.64 6.35,72.77 | v35.31,58.67 34.42,58.67 30.86,62.23 30.86,62.99 29.34,64.52 29.08,64.52 26.8,66.8 v24.64,66.8
HP_COMFB  (via drill 0.35)
  Top 0.152: U$1.124 35.91,59.18 34.92,59.18 v34.67,59.44
  Bottom 0.152: R26.1 9.49,73.28 v11.68,73.28 12.38,73.28 12.83,72.83 14.03,72.83 14.99,71.88 15.75,71.88 20.19,67.44 26.67,67.44 29.08,65.02 29.46,65.02 31.5,62.99 32.26,62.99 32.77,62.48 32.77,61.34 v34.67,59.44
HP_L  (via drill 0.35)
  Top 0.152: J2.TIP 11.86,74.37 12.7,73.53 v13.46,73.53 | U$1.121 37.1,59.69 36.7,59.69 v36.07,60.33
  Route2 0.152: v36.07,60.33 36.07,60.96 29.08,67.94 21.72,67.94 16.13,73.53 v13.46,73.53
HP_R  (via drill 0.35)
  Top 0.152: J2.RING1 7.42,74.37 9.14,72.64 v15.49,72.64 | U$1.120 37.34,60.02 v37.34,60.2
  Route2 0.152: v37.34,60.2 29.21,68.33 27.69,68.33 27.56,68.46 v22.48,68.46
  Route15 0.152: v22.48,68.46 20.32,68.46 16.13,72.64 v15.49,72.64
I2C0/SCL  (via drill 0.35)
  Top 0.152: U$1.45 51.75,47.87 51.88,47.87 56.38,43.37 58.09,43.37 v58.32,43.6 | v61.59,52.32 62.17,52.9 62.17,55.88 64.71,58.42 64.71,61.66 66.17,63.12 66.17,68.07 67.94,69.85 JP1.5
  Route2 0.152: v58.32,43.6 61.15,46.43 61.15,51.88 v61.59,52.32
I2C0/SDA  (via drill 0.35)
  Top 0.152: U$1.46 56.38,43.81 57.53,43.81 v57.72,44 | v61.28,53.15 61.28,55.75 63.94,58.42 63.94,61.85 65.53,63.44 65.53,68.33 69.6,72.39 JP1.3
  Route2 0.152: v57.72,44 60.71,46.98 60.71,52.58 v61.28,53.15
I2C1/SCL  (via drill 0.35)
  Top 0.152: R38.2 34.29,12.95 34.42,12.83 37.59,12.83 v38.07,12.35 38.48,11.94 38.48,10.03 38.3,9.86 U$8.10 36.4,9.86 35.94,9.4 35.94,7.68 36.13,7.49 41.78,7.49 44.7,4.57 57.91,4.57 62.28,8.94 62.28,12.75 v62.48,12.95 | R65.2 28.22,37.36 v27.94,37.08 27.56,36.7 22.23,36.7 21.98,36.46 U$5.53 | v35.81,49.97 36.01,50.16 36.46,50.16 37.15,50.85 37.15,51.55 U$1.9 | J4.3 69.77,90.5 v69.85,90.42 | JP6.3 77.98,25.15 78.17,25.34 81.92,25.34 82.49,25.91 JP10.3